# Altium project SVPXFMC_Carrier_3U.PrjPcb (part 5 of 7)

## Sheet FPGA_Config.SchDoc: SVPXFMC Carrier 3U
size 420 x 297 mm; CheckedBy: \; Author: G.Kasprowicz; CompanyName: ISE; DrawnBy: T.Przywozki; Organization: WUT ISE; Address1: Warsaw University of Technology; Address2: Nowowiejska 15/19 00-665 Warsaw; Revision: 1.0.; SheetNumber: 7; SheetTotal: 20; Project: SVPXFMC Carrier 3U; ModifiedBy: -; CheckedDate: -; Title2: FPGA Config; DivGrp: ISE; Designer: G. Kasprowicz
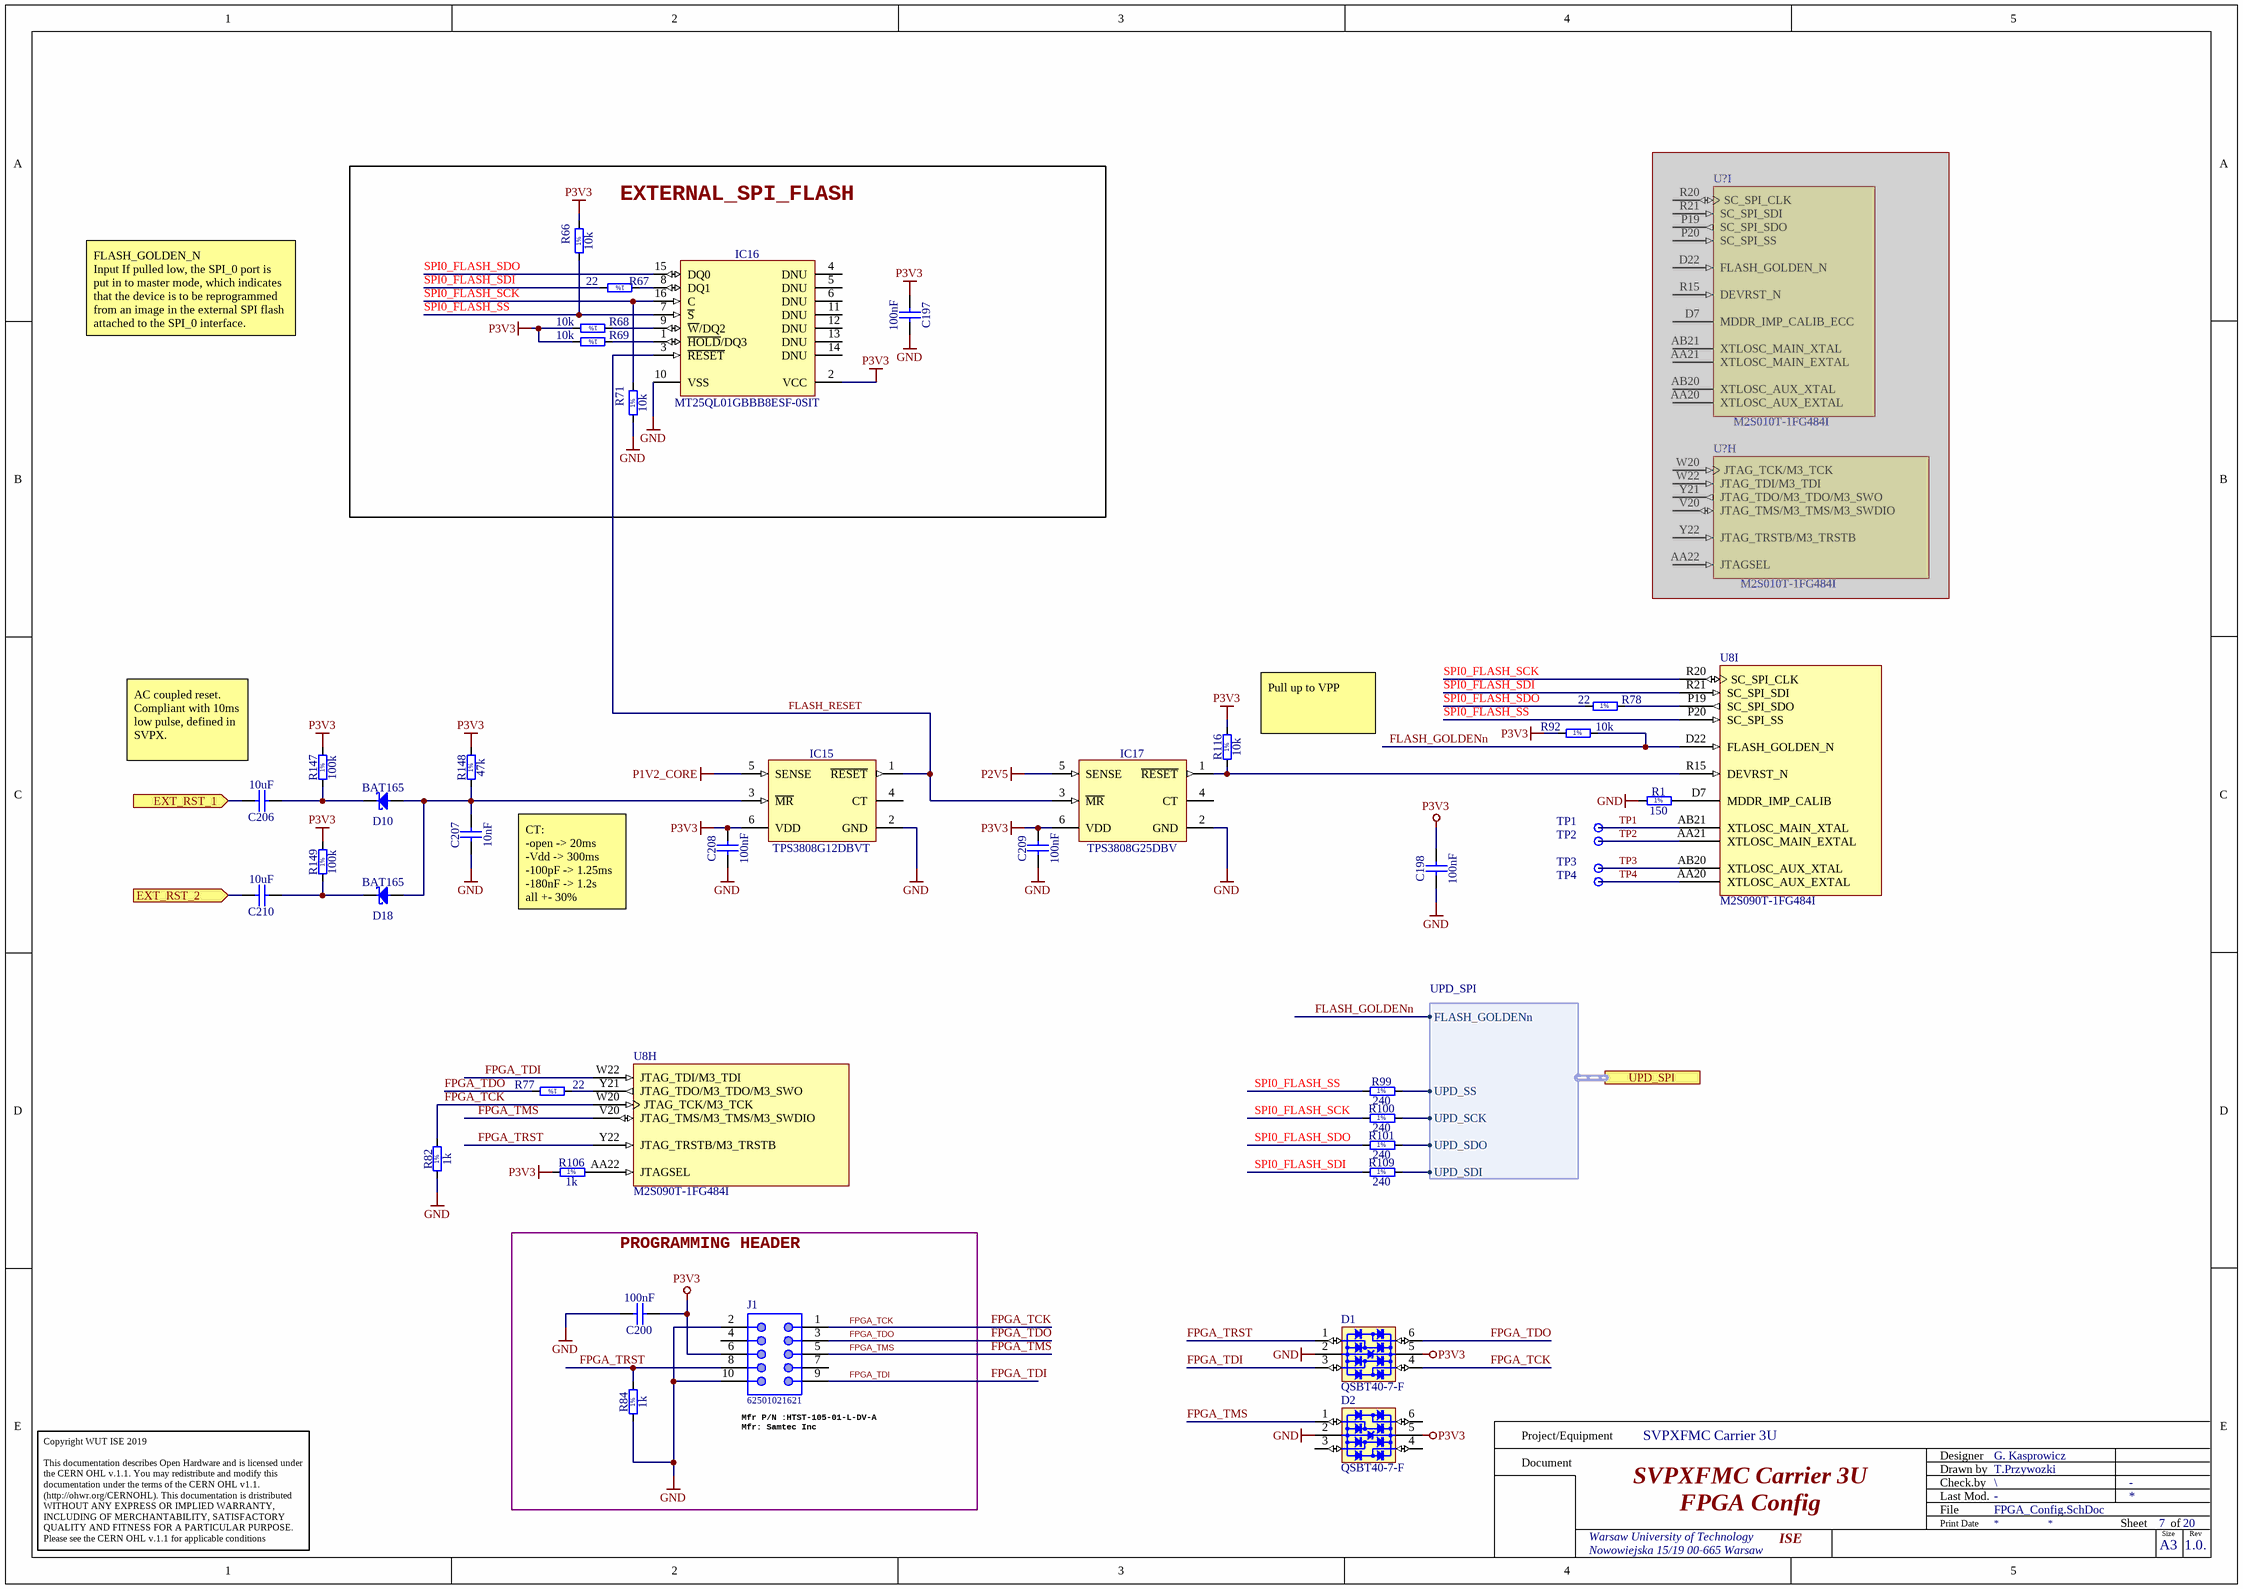
[diagram p10: FPGA_Config.SchDoc]

### Parts
(Parts that share a designator on the sheet are numbered #1, #2 ... from top to bottom, then left to right.)
C197  100nF  [CAPC0603X33N]
C198  100nF  [CAPC0603X33N]
C200  100nF  [CAPC0603X33N]
C206  10uF  [CAPC1608X80N]
C207  10nF  [CAPC1005X55N]
C208  100nF  [CAPC1005X55N]
C209  100nF  [CAPC1005X55N]
C210  10uF  [CAPC1608X80N]
D1  QSBT40-7-F  [SOT65P210X110-6N]
D2  QSBT40-7-F  [SOT65P210X110-6N]
D10  BAT165  [SOD2512X110N]
D18  BAT165  [SOD2512X110N]
IC15  TPS3808G12DBVT  [SOT95P280X145-6N]
IC16  MT25QL01GBBB8ESF-0SIT  [SOIC127P1030X265-16N]
IC17  TPS3808G25DBV  [SOT95P280X145-6N]
J1  62501021621  [62501021621]
R1  150  [RESC1005X40N]
R66  10k  [RESC1005X40N]
R67  22  [RESC1005X40N]
R68  10k  [RESC1005X40N]
R69  10k  [RESC1005X40N]
R71  10k  [RESC1005X40N]
R77  22  [RESC1005X40N]
R78  22  [RESC1005X40N]
R82  1k  [RESC1005X40N]
R84  1k  [RESC1005X40N]
R92  10k  [RESC1005X40N]
R99  240  [RESC1005X40N]
R100  240  [RESC1005X40N]
R101  240  [RESC1005X40N]
R106  1k  [RESC1005X40N]
R109  240  [RESC1005X40N]
R116  10k  [RESC1005X40N]
R147  100k  [RESC1005X40N]
R148  47k  [RESC1005X40N]
R149  100k  [RESC1005X40N]
TP1  Test Point  [TPS127]  (value not drawn)
TP2  Test Point  [TPS127]  (value not drawn)
TP3  Test Point  [TPS127]  (value not drawn)
TP4  Test Point  [TPS127]  (value not drawn)
U8  M2S090T-1FG484I  [MCSM-FG-484_V]  (parts H,I of 15)
U?#12  M2S010T-1FG484I  [MCSM-FG-484_V]  (part I of 16)  (masked out: inside a compile mask, not in the netlist)
U?#13  M2S010T-1FG484I  [MCSM-FG-484_V]  (part H of 16)  (masked out: inside a compile mask, not in the netlist)

### Blocks framed on the sheet
EXTERNAL_SPI_FLASH: C197 IC16 R66-R69 R71
PROGRAMMING HEADER: C200 J1 R84

### Ports
EXT_RST_1 (in), EXT_RST_2 (in), UPD_SPI (harness UPD_SPI)

### Harnesses
UPD_SPI: UPD_SS, UPD_SCK, UPD_SDO, UPD_SDI, FLASH_GOLDENn

### Nets
GND: C197.1 C198.1 C200.2 C207.1 C208.1 C209.1 D1.2(GND) D2.2(GND) IC15.2(GND) IC16.10(VSS) IC17.2(GND) J1.2 J1.10 R1.1 R71.1 R82.1 R84.1
P1V2_CORE: IC15.5(SENSE)
P2V5: IC17.5(SENSE)
P3V3: C197.2 C198.2 C200.1 C208.2 C209.2 D1.5(VBUS) D2.5(VBUS) IC15.6(VDD) IC16.2(VCC) IC17.6(VDD) J1.6 R66.2 R68.2 R69.2 R92.1 R106.1 R116.2 R147.2 R148.2 R149.2
EXT_RST_2: C210.2 ; port EXT_RST_2
FLASH_GOLDENn: R92.2 U8.D22(FLASH_GOLDEN_N) ; port UPD_SPI.FLASH_GOLDENn
FLASH_RESET: IC15.1(~{RESET}) IC16.3(~{RESET}) IC17.3(~{MR})  [project net FLASH_RESET_7]
FPGA_TCK: D1.4(I/O3) J1.1 R82.2 U8.W20(JTAG_TCK/M3_TCK)  [project net FPGA_TCK_7]
FPGA_TDI: D1.3(I/O2) J1.9 U8.W22(JTAG_TDI/M3_TDI)  [project net FPGA_TDI_7]
FPGA_TDO: D1.6(I/O4) J1.3 R77.2  [project net FPGA_TDO_7]
FPGA_TMS: D2.1(I/O1) J1.5 U8.V20(JTAG_TMS/M3_TMS/M3_SWDIO)  [project net FPGA_TMS_7]
FPGA_TRST: D1.1(I/O1) J1.8 R84.2 U8.Y22(JTAG_TRSTB/M3_TRSTB)  [project net FPGA_TRST_7]
SPI0_FLASH_SCK: IC16.16(C) R71.2 R100.1 U8.R20(SC_SPI_CLK)  [project net SPI0_FLASH_SCK_7]
SPI0_FLASH_SDI: R67.2 R109.1 U8.R21(SC_SPI_SDI)  [project net SPI0_FLASH_SDI_7]
SPI0_FLASH_SDO: IC16.15(DQ0) R78.1 R101.1  [project net SPI0_FLASH_SDO_7]
SPI0_FLASH_SS: IC16.7(~{S}) R66.1 R99.1 U8.P20(SC_SPI_SS)  [project net SPI0_FLASH_SS_7]
SYSRESET*: C206.2 ; port EXT_RST_1
TP1: TP1.1 U8.AB21(XTLOSC_MAIN_XTAL)  [project net TP1_7]
TP2: TP2.1 U8.AA21(XTLOSC_MAIN_EXTAL)  [project net TP2_7]
TP3: TP3.1 U8.AB20(XTLOSC_AUX_XTAL)  [project net TP3_7]
TP4: TP4.1 U8.AA20(XTLOSC_AUX_EXTAL)  [project net TP4_7]
UPD_SCK: R100.2 ; port UPD_SPI.UPD_SCK
UPD_SDI: R109.2 ; port UPD_SPI.UPD_SDI
UPD_SDO: R101.2 ; port UPD_SPI.UPD_SDO
UPD_SS: R99.2 ; port UPD_SPI.UPD_SS
NetC206_1: C206.1 D10.1(C) R147.1
NetC207_2: C207.2 D10.2(A) D18.2(A) IC15.3(~{MR}) R148.1
NetC210_1: C210.1 D18.1(C) R149.1
NetIC16_1: IC16.1(~{HOLD}/DQ3) R69.1
NetIC16_8: IC16.8(DQ1) R67.1
NetIC16_9: IC16.9(~{W}/DQ2) R68.1
NetIC17_1: IC17.1(~{RESET}) R116.1 U8.R15(DEVRST_N)
NetR1_2: R1.2 U8.D7(MDDR_IMP_CALIB)
NetR77_1: R77.1 U8.Y21(JTAG_TDO/M3_TDO/M3_SWO)
NetR78_2: R78.2 U8.P19(SC_SPI_SDO)
NetR106_2: R106.2 U8.AA22(JTAGSEL)

Not connected (* = marked no-connect by the designer): D2 3(I/O2) 4(I/O3) 6(I/O4); IC15 4(CT); IC16 4(DNU) 5(DNU) 6(DNU) 11(DNU) 12(DNU) 13(DNU) 14(DNU); IC17 4(CT); J1 4 7

### Notes on the sheet
- FLASH_GOLDEN_N
  Input If pulled low, the SPI_0 port is put in to master mode, which indicates that the device is to be reprogrammed from an image in the external SPI flash attached to the SPI_0 interface.
- (near R116) Pull up to VPP
- (near C206) AC coupled reset. Compliant with 10ms low pulse, defined in SVPX.
- CT:
  -open -> 20ms
  -Vdd -> 300ms
  -100pF -> 1.25ms
  -180nF -> 1.2s
  all +- 30%
- (near J1) Mfr P/N :HTST-105-01-L-DV-A
  Mfr: Samtec Inc
- Project/Equipment
- Document
- Designer
- Drawn by
- Check.by
- File
- Last Mod.
- Print Date
- Sheet
- Size
- A3
- of
- Rev
- Copyright WUT ISE 2019
  This documentation describes Open Hardware and is licensed under the CERN OHL v.1.1. You may redistribute and modify this documentation under the terms of the CERN OHL v1.1.
  (http://ohwr.org/CERNOHL). This documentation is dristributed WITHOUT ANY EXPRESS OR IMPLIED WARRANTY, INCLUDING OF MERCHANTABILITY, SATISFACTORY QUALITY AND FITNESS FOR A PARTICULAR PURPOSE. Please see the CERN OHL v.1.1 for applicable conditions
- (in symbol R0402_1K_1%_0.0625W_100PPM) 1%
- (in symbol R0402_10K_1%_0.0625W_100PPM) 1%
- (in symbol R0402_22R_1%_0.0625W_100PPM) 1%
- (in symbol R0402_47K_1%_0.0625W_100PPM) 1%
- (in symbol R0402_100K_1%_0.0625W_100PPM) 1%
- (in symbol R0402_150R_1%_0.0625W_100PPM) 1%
- (in symbol R0402_240R_1%_0.0625W_100PPM) 1%

### Library data of the parts
C197 C200 = CC0201_100NF_6.3V_10%_X5R: as C34 on sheet FPGA Supply; Part Number: CC0201_100NF_6.3V_10%_X5R; Component Kind: Standard; Component Type: Standard; Pin Count: 2; Value: 100nF; Status: Not Recommended; Manufacturer Part Number: CC0201_100NF_6.3V_10%_X5R; Case: 0201; Mounted: Yes; Socket: No; SMD: Yes; Sense: No; Manufacturer1 Example: AVX; Manufacturer1 ComponentHeight: 0.33mm; HelpURL: \\cern.ch\dfs\Applications\Altium\Datasheets\CC0201_X5R_AVX.pdf; Author: CERN DEM JLC; CreateDate: 03/12/2007; LatestRevisionDate: 03/12/2007
C198 = CC0201_100NF_6.3V_10%_X5R: Non-polarised capacitor; Manufacturer: GENERIC; Part Description: SMD Multilayer Chip Ceramic Capacitor; Manufacturer1 Part Number: 02016D104KAT2A; Tolerance: ±10%; Voltage: 6.3V; TC: X5R; Part Number: CC0201_100NF_6.3V_10%_X5R; Component Kind: Standard; Component Type: Standard; Pin Count: 2; Value: 100nF; Status: Not Recommended; Manufacturer Part Number: CC0201_100NF_6.3V_10%_X5R; Case: 0201; Mounted: Yes; Socket: No; SMD: Yes; Sense: No; Manufacturer1 Example: AVX; Manufacturer1 ComponentHeight: 0.33mm; HelpURL: \\cern.ch\dfs\Applications\Altium\Datasheets\CC0201_X5R_AVX.pdf; Author: CERN DEM JLC; CreateDate: 03/12/2007; LatestRevisionDate: 03/12/2007
C206 C210 = CC0603_10UF_16V_20%_X5R: Non-polarised capacitor; Part Description: SMD Multilayer Chip Ceramic Capacitor; Manufacturer: GENERIC; Manufacturer1 Part Number: GRM188R61C106MA73D; Voltage: 16V; TC: X5R; Tolerance: ±20%; Part Number: CC0603_10UF_16V_20%_X5R; Component Kind: Standard; Component Type: Standard; Pin Count: 2; Value: 10uF; Status: None; Manufacturer Part Number: CC0603_10UF_16V_20%_X5R; Case: 0603; Mounted: Yes; Socket: No; SMD: Yes; Sense: No; Manufacturer1 Example: MURATA; Manufacturer1 ComponentHeight: 0.8mm; HelpURL: \\cern.ch\dfs\Applications\Altium\Datasheets\CC0603_X5R_MURATA_GRM.pdf; Author: CERN DEM MR; CreateDate: 2016-03-02; LatestRevisionDate: 2016-03-02
C207 = CC0402_10NF_50V_10%_X7R: Non-polarised capacitor; Part Description: SMD Multilayer Chip Ceramic Capacitor; Manufacturer: GENERIC; Manufacturer1 Part Number: GRM155R71H103KA88D; Voltage: 50V; TC: X7R; Tolerance: ±10%; Part Number: CC0402_10NF_50V_10%_X7R; Component Kind: Standard; Component Type: Standard; Pin Count: 2; Value: 10nF; Status: None; Manufacturer Part Number: CC0402_10NF_50V_10%_X7R; Case: 0402; Mounted: Yes; Socket: No; SMD: Yes; Sense: No; Manufacturer1 Example: MURATA; Manufacturer1 ComponentHeight: 0.55mm; HelpURL: \\cern.ch\dfs\Applications\Altium\Datasheets\CC0402_X7R_MURATA_GRM.pdf; Author: CERN DEM MR; CreateDate: 08.01.2016; LatestRevisionDate: 08.01.2016
C208 C209 = CC0402_100NF_25V_10%_X7R_YUDEN_TMK105B7104KVHF: as C6 on sheet Power_supply; Part Number: CC0402_100NF_25V_10%_X7R_YUDEN_TMK105B7104KVHF; Component Kind: Standard; Component Type: Standard; Pin Count: 2; Value: 100nF; Status: Not Recommended; Manufacturer Part Number: TMK105B7104KVHF; Case: 0402; Mounted: Yes; Socket: No; SMD: Yes; Sense: No; HelpURL: \\cern.ch\dfs\Applications\Altium\Datasheets\CC0402_TAIYO-YUDEN_TMK105B7104KVHF.pdf; Author: CERN DEM JLC; CreateDate: 10.05.2017; LatestRevisionDate: 10.05.2017; ComponentHeight: 0.55mm
D1 D2 = D_TVS_QSBT40-7-F: Bonding: No; PressFit: No; Case: *; Component Kind: Standard; Component Type: Standard; ComponentHeigth: *; CreateDate: 2018-01-01; Device: QSBT40-7-F; Footprint: SOT363; HelpURL: *; LatestRevisionDate: 2018-01-01; Manufacturer: *; Manufacturer Part Number: QSBT40-7-F; Mounted: Yes; PackageDescription: *; Part Description: *; Part Number: *; Pin Count: 6; Sense: No; SMD: Yes; Socket: No; Value: *
D10 D18 = BAT165: Schottky Diode; Part Description: Medium Power AF Schottky Diode; Manufacturer: INFINEON; Voltage: 40V; Power: 750mA; PressFit: No; Bonding: No; Part Number: BAT165; Component Kind: Standard; Component Type: Standard; Device: BAT165; PackageDescription: Small Outline Diode (SOD-323), 1.70mm W X 1.25mm L X 1.10mm H body,  IPC Medium Density; Manufacturer Part Number: BAT165; Pin Count: 2; Case: SOD323; Mounted: Yes; Socket: No; SMD: Yes; Sense: No; ComponentHeight: 1.1mm; HelpURL: \\cern.ch\dfs\Applications\Altium\Datasheets\BAT165.pdf; Author: CERN DEM JLC; CreateDate: 12.11.2014; LatestRevisionDate: 12.11.2014
IC15 = TPS3808G12DBVT: Low Quiescent Current, Programmable-Delay Supervisory Circuit; Part Description: 1.2V, Low Quiescent Current, Programmable-Delay Supervisory Circuit; Manufacturer: TEXAS INSTRUMENTS; PressFit: No; Bonding: No; Part Number: TPS3808G12DBVT; Component Kind: Standard; Component Type: Standard; Device: TPS3808G12DBVT; PackageDescription: SOT23, 6-Leads, Body 1.6x3.0mm, Pitch 0.95mm, IPC Medium Density; Manufacturer Part Number: TPS3808G12DBVT; Pin Count: 6; Case: SOT23-6; Mounted: Yes; Socket: No; SMD: Yes; Sense: No; ComponentHeight: 1.45mm; Author: CERN DEM JLC; HelpURL: \\cern.ch\dfs\Applications\Altium\Datasheets\TPS3808G12DBVT.pdf; CreateDate: 05.11.2013; LatestRevisionDate: 05.11.2013
IC16 = MEM_MT25QL01GBBB8ESF-0SIT: 1Gbit (128MB), 3.3V, Multiple I/O Serial Flash Memory, Reset# & Hold# Pinset# & Hold# Pins; Manufacturer: MICRON TECHNOLOGY; PressFit: No; Bonding: No; Part Number: MT25QL01GBBB8ESF-0SIT; Component Kind: Standard; Component Type: Standard; Device: MT25QL01GBBB8ESF-0SIT; PackageDescription: SOIC 16, Pitch 1.27mm - Body 7.5x10.3mm, IPC Medium Density; Part Description: 1Gbit (128MB), 3.3V, Multiple I/O Serial Flash Memory, Reset# & Hold# Pins; Manufacturer Part Number: MT25QL01GBBB8ESF-0SIT; Pin Count: 16; Case: SOIC16; Mounted: Yes; Socket: No; SMD: Yes; Sense: No; ComponentHeight: 2.65mm; HelpURL: \\cern.ch\dfs\Applications\Altium\Datasheets\MT25QL01GBBB8ESF-0SIT.pdf; Author: CERN DEM MR; CreateDate: 26/01/2018; LatestRevisionDate: 26/01/2018
IC17 = TPS3808G25DBV: Low Quiescent Current, Programmable-Delay Supervisory Circuit; Part Description: 2.5V, Low Quiescent Current, Programmable-Delay Supervisory Circuit; Manufacturer: TEXAS INSTRUMENTS; PressFit: No; Bonding: No; Part Number: TPS3808G25DBV; Component Kind: Standard; Component Type: Standard; Device: TPS3808G25DBV; PackageDescription: SOT23, 6-Leads, Body 1.6x3.0mm, Pitch 0.95mm, IPC Medium Density; Manufacturer Part Number: TPS3808G25DBV; Pin Count: 6; Case: SOT23-6; Mounted: Yes; Socket: No; SMD: Yes; Sense: No; ComponentHeight: 1.45mm; Author: CERN DEM MR; HelpURL: \\cern.ch\dfs\Applications\Altium\Datasheets\TPS3808G25DBV.pdf; CreateDate: 13.07.2016; LatestRevisionDate: 13.07.2016
J1 = 62501021621: Male Box Header WR-BHD with long lever, THT, Vertical, pitch 2.00 mm, 10 pins; Pin Number: 10; Pitch: 2.00 mm; Working Voltage: 250 VAC; Withstanding Voltage: 500 VAC; Contact Resistance: 20 mOhm; ComponentLink1Description: Manufacturer; ComponentLink1URL: http://www.we-online.de; ComponentLink2Description: Datasheet; ComponentLink2URL: https://katalog.we-online.de/em/datasheet/6250xx21621.pdf; Part Number: 62501021621; Published Date: August 2018; Publisher: Wurth Elektronik; Operating Temperature: -40 to 125 degC; Packaging: Tray; Gender: Male; Mounting Technology: THT; Orientation: Vertical
R1 = R0402_150R_1%_0.0625W_100PPM: Resistor - 1%; Part Description: General Purpose Thick Film Chip Resistor; Manufacturer: GENERIC; Manufacturer1 Part Number: 232270671501L; TC: ±100ppm/°C; PressFit: No; Part Number: R0402_150R_1%_0.0625W_100PPM; Component Kind: Standard; Component Type: Standard; Pin Count: 2; Value: 150; Status: Not Recommended; Power: 0.0625W; Tolerance: ±1%; Manufacturer Part Number: R0402_150R_1%_0.0625W_100PPM; Case: 0402; Mounted: Yes; Sense: No; Socket: No; SMD: Yes; Manufacturer1 Example: YAGEO PHYCOMP; Manufacturer1 ComponentHeight: 0.4mm; HelpURL: \\cern.ch\dfs\Applications\Altium\Datasheets\R0402_Phycomp_RC0402.pdf; Author: CERN DEM JLC; CreateDate: 03.12.2007; LatestRevisionDate: 17.10.2012
R66 R68 R69 R71 R92 = R0402_10K_1%_0.0625W_100PPM: Resistor - 1%; Manufacturer: GENERIC; Part Description: General Purpose Thick Film Chip Resistor; Manufacturer1 Part Number: 232270671003L; TC: ±100ppm/°C; PressFit: No; Manufacturer Part Number: R0402_10K_1%_0.0625W_100PPM; Part Number: R0402_10K_1%_0.0625W_100PPM; Tolerance: ±1%; Value: 10k; Component Kind: Standard; Component Type: Standard; Pin Count: 2; Status: Not Recommended; Power: 0.0625W; Case: 0402; Mounted: Yes; Sense: No; Socket: No; SMD: Yes; Manufacturer1 Example: YAGEO PHYCOMP; Manufacturer1 ComponentHeight: 0.4mm; HelpURL: \\cern.ch\dfs\Applications\Altium\Datasheets\R0402_Phycomp_RC0402.pdf; Author: CERN DEM JLC; CreateDate: 03/12/2007; LatestRevisionDate: 17/10/2012
R67 R77 = R0402_22R_1%_0.0625W_100PPM: Resistor - 1%; Manufacturer: GENERIC; Part Description: General Purpose Thick Film Chip Resistor; Manufacturer1 Part Number: 232270672209L; TC: ±100ppm/°C; PressFit: No; Part Number: R0402_22R_1%_0.0625W_100PPM; Component Kind: Standard; Component Type: Standard; Pin Count: 2; Value: 22; Status: Not Recommended; Power: 0.0625W; Tolerance: ±1%; Manufacturer Part Number: R0402_22R_1%_0.0625W_100PPM; Case: 0402; Mounted: Yes; Sense: No; Socket: No; SMD: Yes; Manufacturer1 Example: YAGEO PHYCOMP; Manufacturer1 ComponentHeight: 0.4mm; HelpURL: \\cern.ch\dfs\Applications\Altium\Datasheets\R0402_Phycomp_RC0402.pdf; Author: CERN DEM JLC; CreateDate: 03/12/2007; LatestRevisionDate: 17/10/2012
R78 = R0402_22R_1%_0.0625W_100PPM: Resistor - 1%; Part Description: General Purpose Thick Film Chip Resistor; Manufacturer: GENERIC; Manufacturer1 Part Number: 232270672209L; TC: ±100ppm/°C; PressFit: No; Part Number: R0402_22R_1%_0.0625W_100PPM; Component Kind: Standard; Component Type: Standard; Pin Count: 2; Value: 22; Status: Not Recommended; Power: 0.0625W; Tolerance: ±1%; Manufacturer Part Number: R0402_22R_1%_0.0625W_100PPM; Case: 0402; Mounted: Yes; Sense: No; Socket: No; SMD: Yes; Manufacturer1 Example: YAGEO PHYCOMP; Manufacturer1 ComponentHeight: 0.4mm; HelpURL: \\cern.ch\dfs\Applications\Altium\Datasheets\R0402_Phycomp_RC0402.pdf; Author: CERN DEM JLC; CreateDate: 03/12/2007; LatestRevisionDate: 17/10/2012
R82 R84 R106 = R0402_1K_1%_0.0625W_100PPM: Resistor - 1%; Part Description: General Purpose Thick Film Chip Resistor; Manufacturer: GENERIC; Manufacturer1 Part Number: 232270671002L; TC: ±100ppm/°C; PressFit: No; Part Number: R0402_1K_1%_0.0625W_100PPM; Component Kind: Standard; Component Type: Standard; Pin Count: 2; Value: 1k; Status: Not Recommended; Power: 0.0625W; Tolerance: ±1%; Manufacturer Part Number: R0402_1K_1%_0.0625W_100PPM; Case: 0402; Mounted: Yes; Sense: No; Socket: No; SMD: Yes; Manufacturer1 Example: YAGEO PHYCOMP; Manufacturer1 ComponentHeight: 0.4mm; HelpURL: \\cern.ch\dfs\Applications\Altium\Datasheets\R0402_Phycomp_RC0402.pdf; Author: CERN DEM JLC; CreateDate: 03/12/2007; LatestRevisionDate: 17/10/2012
R99-R101 R109 = R0402_240R_1%_0.0625W_100PPM: Resistor - 1%; Part Description: General Purpose Thick Film Chip Resistor; Manufacturer: GENERIC; Manufacturer1 Part Number: 232270672401L; TC: ±100ppm/°C; PressFit: No; Part Number: R0402_240R_1%_0.0625W_100PPM; Component Kind: Standard; Component Type: Standard; Pin Count: 2; Value: 240; Status: Not Recommended; Power: 0.0625W; Tolerance: ±1%; Manufacturer Part Number: R0402_240R_1%_0.0625W_100PPM; Case: 0402; Mounted: Yes; Sense: No; Socket: No; SMD: Yes; Manufacturer1 Example: YAGEO PHYCOMP; Manufacturer1 ComponentHeight: 0.4mm; HelpURL: \\cern.ch\dfs\Applications\Altium\Datasheets\R0402_Phycomp_RC0402.pdf; Author: CERN DEM JLC; CreateDate: 03/12/2007; LatestRevisionDate: 17/10/2012
R116 = R0402_10K_1%_0.0625W_100PPM: Resistor - 1%; Part Description: General Purpose Thick Film Chip Resistor; Manufacturer: GENERIC; Manufacturer1 Part Number: 232270671003L; TC: ±100ppm/°C; PressFit: No; Part Number: R0402_10K_1%_0.0625W_100PPM; Component Kind: Standard; Component Type: Standard; Pin Count: 2; Value: 10k; Status: Not Recommended; Power: 0.0625W; Tolerance: ±1%; Manufacturer Part Number: R0402_10K_1%_0.0625W_100PPM; Case: 0402; Mounted: Yes; Sense: No; Socket: No; SMD: Yes; Manufacturer1 Example: YAGEO PHYCOMP; Manufacturer1 ComponentHeight: 0.4mm; HelpURL: \\cern.ch\dfs\Applications\Altium\Datasheets\R0402_Phycomp_RC0402.pdf; Author: CERN DEM JLC; CreateDate: 03.12.2007; LatestRevisionDate: 17.10.2012
R147 R149 = R0402_100K_1%_0.0625W_100PPM: Resistor - 1%; Part Description: General Purpose Thick Film Chip Resistor; Manufacturer: GENERIC; Manufacturer1 Part Number: 232270671004L; TC: ±100ppm/°C; PressFit: No; Part Number: R0402_100K_1%_0.0625W_100PPM; Component Kind: Standard; Component Type: Standard; Pin Count: 2; Value: 100k; Status: Not Recommended; Power: 0.0625W; Tolerance: ±1%; Manufacturer Part Number: R0402_100K_1%_0.0625W_100PPM; Case: 0402; Mounted: Yes; Sense: No; Socket: No; SMD: Yes; Manufacturer1 Example: YAGEO PHYCOMP; Manufacturer1 ComponentHeight: 0.4mm; HelpURL: \\cern.ch\dfs\Applications\Altium\Datasheets\R0402_Phycomp_RC0402.pdf; Author: CERN DEM JLC; CreateDate: 03.12.2007; LatestRevisionDate: 17.10.2012
R148 = R0402_47K_1%_0.0625W_100PPM: Resistor - 1%; Part Description: General Purpose Thick Film Chip Resistor; Manufacturer: GENERIC; Manufacturer1 Part Number: 232270675103L; TC: ±100ppm/°C; PressFit: No; Part Number: R0402_47K_1%_0.0625W_100PPM; Component Kind: Standard; Component Type: Standard; Pin Count: 2; Value: 47k; Status: Not Recommended; Power: 0.0625W; Tolerance: ±1%; Manufacturer Part Number: R0402_47K_1%_0.0625W_100PPM; Case: 0402; Mounted: Yes; Sense: No; Socket: No; SMD: Yes; Manufacturer1 Example: YAGEO PHYCOMP; Manufacturer1 ComponentHeight: 0.4mm; HelpURL: \\cern.ch\dfs\Applications\Altium\Datasheets\R0402_Phycomp_RC0402.pdf; Author: CERN DEM JLC; CreateDate: 03.12.2007; LatestRevisionDate: 17.10.2012
TP1-TP4 = SMD_PAD_1.27X1.27MM: as TP9 on sheet Power_supply; Part Number: SMD_PAD_1.27X1.27MM; Component Kind: Standard (No BOM); Component Type: Standard (No BOM); Pin Count: 1; Family: Test Point; Socket: No; SMD: Yes; Sense: No; Status: None; ComponentHeight: 0mm; HelpURL: Undefined; Author: CERN DEM JLC; CreateDate: 12.01.2008; LatestRevisionDate: 12.01.2008; PackageDescription: 1.27mm x 1.27mm PCB Copper Area (SMD Test Point)
U8 = CMP-0959-00045-1: as U8 on sheet FPGA SDRAM bank; ComponentLink3URL: http://www.microsemi.com/document-portal/doc_download/131095-package-mechanical-drawings; DatasheetVersion: Rev. 5; ComponentLink3Description: Package Specification; ComponentLink1Description: Manufacturer URL; PackageReference: FG-484; RoHS: FALSE; ComponentLink1URL: http://www.microsemi.com/; Code_JEDEC: MS-034; Mounting Technology: Surface Mount; PackageDescription: 484-Ball Fine Pitch Plastic Ball Grid Array (FBGA), Body 23 x 23 mm, Pitch 1 mm; PackageVersion: Rev. 48, 11/2013; ComponentLink2URL: http://www.microsemi.com/document-portal/doc_download/130717-smartfusion2-datasheet; PartNumber: M2S090T-1FG484I; ComponentLink2Description: Datasheet; PartId: 1
U?#12 U?#13 = CMP-0959-00069-1: as U?#7 on sheet FPGA SDRAM bank; PackageVersion: Rev. 48, 11/2013; ComponentLink3URL: http://www.microsemi.com/document-portal/doc_download/131095-package-mechanical-drawings; ComponentLink1Description: Manufacturer URL; DatasheetVersion: Rev. 5; RoHS: FALSE; ComponentLink2Description: Datasheet; Code_JEDEC: MS-034; ComponentLink3Description: Package Specification; ComponentLink2URL: http://www.microsemi.com/document-portal/doc_download/130717-smartfusion2-datasheet; PartNumber: M2S010T-1FG484I; ComponentLink1URL: http://www.microsemi.com/; Math Blocks (18x18): 22; Mounting Technology: Surface Mount; PackageDescription: 484-Ball Fine Pitch Plastic Ball Grid Array (FBGA), Body 23 x 23 mm, Pitch 1 mm; PackageReference: FG-484

## Sheet Decoupling_caps.SchDoc: SVPXFMC Carrier 3U
size A4; CheckedBy: \; Author: G.Kasprowicz; CompanyName: ISE; DrawnBy: T.Przywozki; Organization: WUT ISE; Address1: Warsaw University of Technology; Address2: Nowowiejska 15/19 00-665 Warsaw; Revision: 1.0.; SheetNumber: 3; SheetTotal: 20; Projet: SVPXFMC Carrier 3U; ModifiedBy: -; CreateDate: XX/XX/XXXX; CheckedDate: -; Title2: Decoupling Caps; DivGrp: ISE; Designer: G. Kasprowicz; Project: SVPXFMC Carrier 3U
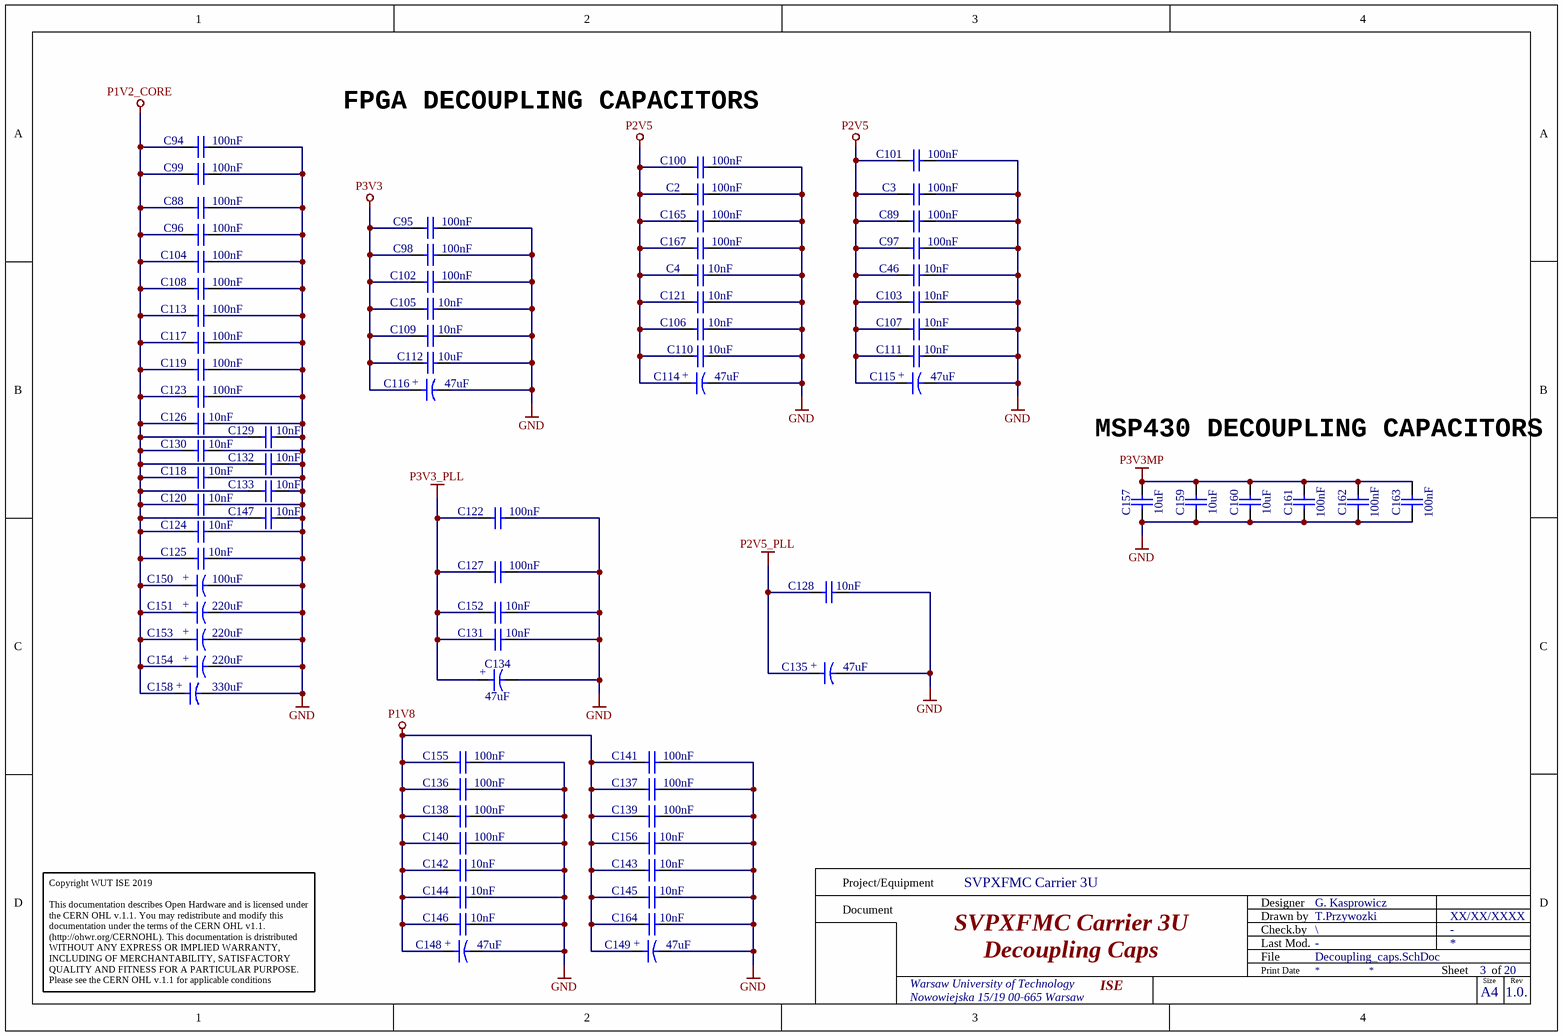
[diagram p11: Decoupling_caps.SchDoc]

### Parts
C2  100nF  [CAPC0603X33N]
C3  100nF  [CAPC0603X33N]
C4  10nF  [CAPC0603X33N]
C46  10nF  [CAPC0603X33N]
C88  100nF  [CAPC0603X33N]
C89  100nF  [CAPC0603X33N]
C94  100nF  [CAPC0603X33N]
C95  100nF  [CAPC0603X33N]
C96  100nF  [CAPC0603X33N]
C97  100nF  [CAPC0603X33N]
C98  100nF  [CAPC0603X33N]
C99  100nF  [CAPC0603X33N]
C100  100nF  [CAPC0603X33N]
C101  100nF  [CAPC0603X33N]
C102  100nF  [CAPC0603X33N]
C103  10nF  [CAPC0603X33N]
C104  100nF  [CAPC0603X33N]
C105  10nF  [CAPC0603X33N]
C106  10nF  [CAPC0603X33N]
C107  10nF  [CAPC0603X33N]
C108  100nF  [CAPC0603X33N]
C109  10nF  [CAPC0603X33N]
C110  10uF  [CAPC2012X135N]
C111  10nF  [CAPC0603X33N]
C112  10uF  [CAPC2012X135N]
C113  100nF  [CAPC0603X33N]
C114  47uF  [CAPMP3528X210N]
C115  47uF  [CAPMP3528X210N]
C116  47uF  [CAPMP3528X210N]
C117  100nF  [CAPC0603X33N]
C118  10nF  [CAPC0603X33N]
C119  100nF  [CAPC0603X33N]
C120  10nF  [CAPC0603X33N]
C121  10nF  [CAPC0603X33N]
C122  100nF  [CAPC0603X33N]
C123  100nF  [CAPC0603X33N]
C124  10nF  [CAPC0603X33N]
C125  10nF  [CAPC0603X33N]
C126  10nF  [CAPC0603X33N]
C127  100nF  [CAPC0603X33N]
C128  10nF  [CAPC0603X33N]
C129  10nF  [CAPC0603X33N]
C130  10nF  [CAPC0603X33N]
C131  10nF  [CAPC0603X33N]
C132  10nF  [CAPC0603X33N]
C133  10nF  [CAPC0603X33N]
C134  47uF  [CAPMP3528X210N]
C135  47uF  [CAPMP3528X210N]
C136  100nF  [CAPC0603X33N]
C137  100nF  [CAPC0603X33N]
C138  100nF  [CAPC0603X33N]
C139  100nF  [CAPC0603X33N]
C140  100nF  [CAPC0603X33N]
C141  100nF  [CAPC0603X33N]
C142  10nF  [CAPC0603X33N]
C143  10nF  [CAPC0603X33N]
C144  10nF  [CAPC0603X33N]
C145  10nF  [CAPC0603X33N]
C146  10nF  [CAPC0603X33N]
C147  10nF  [CAPC0603X33N]
C148  47uF  [CAPMP3528X210N]
C149  47uF  [CAPMP3528X210N]
C150  100uF  [CAPMP3528X210N]
C151  220uF  [CAPMP7343X310N]
C152  10nF  [CAPC0603X33N]
C153  220uF  [CAPMP7343X310N]
C154  220uF  [CAPMP7343X310N]
C155  100nF  [CAPC0603X33N]
C156  10nF  [CAPC0603X33N]
C157  10uF  [CAPC1608X80N]
C158  330uF  [CAPMP7343X310N]
C159  10uF  [CAPC1608X80N]
C160  10uF  [CAPC1608X80N]
C161  100nF  [CAPC1005X55N]
C162  100nF  [CAPC1005X55N]
C163  100nF  [CAPC1005X55N]
C164  10nF  [CAPC0603X33N]
C165  100nF  [CAPC0603X33N]
C167  100nF  [CAPC0603X33N]

### Nets
GND: C2.2 C3.2 C4.2 C46.2 C88.2 C89.2 C94.2 C95.2 C96.2 C97.2 C98.2 C99.2 C100.2 C101.2 C102.2 C103.2 C104.2 C105.2 C106.2 C107.2 C108.2 C109.2 C110.2 C111.2 C112.2 C113.2 C114.2 C115.2 C116.2 C117.2 C118.2 C119.2 C120.2 C121.2 C122.2 C123.2 C124.2 C125.2 C126.2 C127.2 C128.2 C129.2 C130.2 C131.2 C132.2 C133.2 C134.2 C135.2 C136.2 C137.2 C138.2 C139.2 C140.2 C141.2 C142.2 C143.2 C144.2 C145.2 C146.2 C147.2 C148.2 C149.2 C150.2 C151.2 C152.2 C153.2 C154.2 C155.2 C156.2 C157.1 C158.2 C159.1 C160.1 C161.1 C162.1 C163.1 C164.2 C165.2 C167.2
P1V2_CORE: C88.1 C94.1 C96.1 C99.1 C104.1 C108.1 C113.1 C117.1 C118.1 C119.1 C120.1 C123.1 C124.1 C125.1 C126.1 C129.1 C130.1 C132.1 C133.1 C147.1 C150.1 C151.1 C153.1 C154.1 C158.1
P1V8: C136.1 C137.1 C138.1 C139.1 C140.1 C141.1 C142.1 C143.1 C144.1 C145.1 C146.1 C148.1 C149.1 C155.1 C156.1 C164.1
P2V5: C2.1 C3.1 C4.1 C46.1 C89.1 C97.1 C100.1 C101.1 C103.1 C106.1 C107.1 C110.1 C111.1 C114.1 C115.1 C121.1 C165.1 C167.1
P2V5_PLL: C128.1 C135.1
P3V3: C95.1 C98.1 C102.1 C105.1 C109.1 C112.1 C116.1
P3V3_PLL: C122.1 C127.1 C131.1 C134.1 C152.1
P3V3MP: C157.2 C159.2 C160.2 C161.2 C162.2 C163.2

### Notes on the sheet
- FPGA DECOUPLING CAPACITORS
- MSP430 DECOUPLING CAPACITORS
- Project/Equipment
- Document
- Designer
- Drawn by
- Check.by
- Copyright WUT ISE 2019
  This documentation describes Open Hardware and is licensed under the CERN OHL v.1.1. You may redistribute and modify this documentation under the terms of the CERN OHL v1.1.
  (http://ohwr.org/CERNOHL). This documentation is dristributed WITHOUT ANY EXPRESS OR IMPLIED WARRANTY, INCLUDING OF MERCHANTABILITY, SATISFACTORY QUALITY AND FITNESS FOR A PARTICULAR PURPOSE. Please see the CERN OHL v.1.1 for applicable conditions
- File
- Last Mod.
- Print Date
- Sheet
- Size
- A4
- of
- Rev
- (in symbol CTE3528-12_47UF_10V_20%_PANASONIC_TPB) +
- (in symbol CTE3528-21_100UF_6.3V_10%) +
- (in symbol CTE7343-31_220UF_6.3V_20%_LESR0009_KEMET_T520) +
- (in symbol CTE7343-31_330UF_6.3V_20%_LESR0025_KEMET_T520) +

### Library data of the parts
C2 C3 C88 C89 C94-C102 C104 C108 C113 C117 C119 C122 C123 C127 C136-C141 C155 C165 C167 = CC0201_100NF_6.3V_10%_X5R: Non-polarised capacitor; Manufacturer: GENERIC; Part Description: SMD Multilayer Chip Ceramic Capacitor; Manufacturer1 Part Number: 02016D104KAT2A; Voltage: 6.3V; TC: X5R; Tolerance: ±10%; Part Number: CC0201_100NF_6.3V_10%_X5R; Component Kind: Standard; Component Type: Standard; Pin Count: 2; Value: 100nF; Status: Not Recommended; Manufacturer Part Number: CC0201_100NF_6.3V_10%_X5R; Case: 0201; Mounted: Yes; Socket: No; SMD: Yes; Sense: No; Manufacturer1 Example: AVX; Manufacturer1 ComponentHeight: 0.33mm; HelpURL: \\cern.ch\dfs\Applications\Altium\Datasheets\CC0201_X5R_AVX.pdf; Author: CERN DEM JLC; CreateDate: 03/12/2007; LatestRevisionDate: 03/12/2007
C4 C46 C103 C105-C107 C109 C111 C118 C120 C121 C124-C126 C128-C133 C142-C147 C152 C156 C164 = CC0201_10NF_10V_10%_X5R: Non-polarised capacitor; Manufacturer: GENERIC; Part Description: SMD Multilayer Chip Ceramic Capacitor; Manufacturer1 Part Number: 0201ZD103KAT2A; Voltage: 10V; TC: X5R; Tolerance: ±10%; Part Number: CC0201_10NF_10V_10%_X5R; Component Kind: Standard; Component Type: Standard; Pin Count: 2; Value: 10nF; Status: Not Recommended; Manufacturer Part Number: CC0201_10NF_10V_10%_X5R; Case: 0201; Mounted: Yes; Socket: No; SMD: Yes; Sense: No; Manufacturer1 Example: AVX; Manufacturer1 ComponentHeight: 0.33mm; HelpURL: \\cern.ch\dfs\Applications\Altium\Datasheets\CC0201_X5R_AVX.pdf; Author: CERN DEM JLC; CreateDate: 03/12/2007; LatestRevisionDate: 03/12/2007
C110 C112 = CC0805_10UF_16V_10%_X5R: Non-polarised capacitor; Part Description: SMD Multilayer Chip Ceramic Capacitor; Manufacturer: GENERIC; Manufacturer1 Part Number: C0805C106K4PAC; Voltage: 16V; TC: X5R; Tolerance: ±10%; Part Number: CC0805_10UF_16V_10%_X5R; Component Kind: Standard; Component Type: Standard; Pin Count: 2; Value: 10uF; Status: Preferred; Manufacturer Part Number: CC0805_10UF_16V_10%_X5R; Case: 0805; Mounted: Yes; Socket: No; SMD: Yes; Sense: No; Manufacturer1 Example: KEMET; Manufacturer1 ComponentHeight: 1.4mm; HelpURL: \\cern.ch\dfs\Applications\Altium\Datasheets\CC1206_X5R_KEMET.pdf; Author: CERN DEM JLC; CreateDate: 03/12/2007; LatestRevisionDate: 03/12/2007
C114-C116 C134 C135 C148 C149 = CTE3528-12_47UF_10V_20%_PANASONIC_TPB: Polarised capacitor; Part Description: ESR 0R07 Tantalum Solid Capacitor with Conductive Polymer; Manufacturer Part Number: 10TPB47M; Voltage: 10V; Tolerance: ±20%; Part Number: CTE3528-12_47UF_10V_20%_PANASONIC_TPB; Component Kind: Standard; Component Type: Standard; Pin Count: 2; Value: 47uF; Status: None; Manufacturer: PANASONIC; Case: B; Mounted: Yes; Socket: No; SMD: Yes; Sense: No; ComponentHeight: 2.1mm; HelpURL: \\cern.ch\dfs\Applications\Altium\Datasheets\CTE_PANASONIC_TPB.pdf; Author: CERN DEM JLC; CreateDate: 01/09/2014; LatestRevisionDate: 01/09/2014
C150 = CTE3528-21_100UF_6.3V_10%: Polarised capacitor; Part Description: Solid Tantalum Chip Capacitor; Manufacturer: GENERIC; Manufacturer1 Part Number: TAJB107K006R; Voltage: 6.3V; Tolerance: ±10%; Part Number: CTE3528-21_100UF_6.3V_10%; Component Kind: Standard; Component Type: Standard; Pin Count: 2; Value: 100uF; Status: Preferred; Manufacturer Part Number: CTE3528-21_100UF_6.3V_10%; Case: B; Mounted: Yes; Socket: No; SMD: Yes; Sense: No; HelpURL: \\cern.ch\dfs\Applications\Altium\Datasheets\CTE_AVX_TAJ.pdf; Author: CERN DEM JLC; CreateDate: 03.12.2007; LatestRevisionDate: 03.12.2007; Manufacturer1 Example: AVX; Manufacturer1 ComponentHeight: 2.1mm
C151 C153 C154 = CTE7343-31_220UF_6.3V_20%_LESR0009_KEMET_T520: Polarised capacitor; Part Description: Low ESR 0R009 Tantalum Chip Capacitor; Manufacturer: KEMET; Manufacturer Part Number: T520D227M006ATE009; Voltage: 6.3V; Tolerance: ±20%; Part Number: CTE7343-31_220UF_6.3V_20%_LESR0009_KEMET_T520; Component Kind: Standard; Component Type: Standard; Pin Count: 2; Value: 220uF; Status: Preferred; Case: D; Mounted: Yes; Socket: No; SMD: Yes; Sense: No; ComponentHeight: 3.1mm; HelpURL: \\cern.ch\dfs\Applications\Altium\Datasheets\CTE-LESR_KEMET_T520.pdf; Author: CERN DEM JLC; CreateDate: 25.10.2012; LatestRevisionDate: 25.10.2012
C157 C159 C160 = CC0603_10UF_16V_20%_X5R: Non-polarised capacitor; Part Description: SMD Multilayer Chip Ceramic Capacitor; Manufacturer: GENERIC; Manufacturer1 Part Number: GRM188R61C106MA73D; Voltage: 16V; TC: X5R; Tolerance: ±20%; Part Number: CC0603_10UF_16V_20%_X5R; Component Kind: Standard; Component Type: Standard; Pin Count: 2; Value: 10uF; Status: None; Manufacturer Part Number: CC0603_10UF_16V_20%_X5R; Case: 0603; Mounted: Yes; Socket: No; SMD: Yes; Sense: No; Manufacturer1 Example: MURATA; Manufacturer1 ComponentHeight: 0.8mm; HelpURL: \\cern.ch\dfs\Applications\Altium\Datasheets\CC0603_X5R_MURATA_GRM.pdf; Author: CERN DEM MR; CreateDate: 02.03.2016; LatestRevisionDate: 02.03.2016
C158 = CTE7343-31_330UF_6.3V_20%_LESR0025_KEMET_T520: Polarised capacitor; Manufacturer: KEMET; Part Description: Low ESR 0R025 Tantalum Chip Capacitor; Manufacturer Part Number: T520D337M006ATE025; Voltage: 6.3V; Tolerance: ±20%; Part Number: CTE7343-31_330UF_6.3V_20%_LESR0025_KEMET_T520; Component Kind: Standard; Component Type: Standard; Pin Count: 2; Value: 330uF; Status: None; Case: D; Mounted: Yes; Socket: No; SMD: Yes; Sense: No; ComponentHeight: 3.1mm; HelpURL: \\cern.ch\dfs\Applications\Altium\Datasheets\CTE-LESR_KEMET_T520.pdf; Author: CERN DEM JLC; CreateDate: 20/10/2010; LatestRevisionDate: 20/10/2010
C161-C163 = CC0402_100NF_25V_10%_X7R_YUDEN_TMK105B7104KVHF: Non-polarised capacitor; Part Description: SMD Multilayer Chip Ceramic Capacitor (High Dielectric Type) for Automotive / Industrial Applications; Manufacturer: TAIYO YUDEN; Voltage: 25V; TC: X7R; Tolerance: ±10%; Part Number: CC0402_100NF_25V_10%_X7R_YUDEN_TMK105B7104KVHF; Component Kind: Standard; Component Type: Standard; Pin Count: 2; Value: 100nF; Status: Not Recommended; Manufacturer Part Number: TMK105B7104KVHF; Case: 0402; Mounted: Yes; Socket: No; SMD: Yes; Sense: No; HelpURL: \\cern.ch\dfs\Applications\Altium\Datasheets\CC0402_TAIYO-YUDEN_TMK105B7104KVHF.pdf; Author: CERN DEM JLC; CreateDate: 10/05/2017; LatestRevisionDate: 10/05/2017; ComponentHeight: 0.55mm

## Sheet FPGA_SpW_Misc.SchDoc: SVPXFMC Carrier 3U
size 420 x 297 mm; CheckedBy: \; Author: G.Kasprowicz; CompanyName: ISE; DrawnBy: T.Przywozki; Organization: WUT ISE; Address1: Warsaw University of Technology; Address2: Nowowiejska 15/19 00-665 Warsaw; Revision: 1.0.; SheetNumber: 11; SheetTotal: 20; Project: SVPXFMC Carrier 3U; ModifiedBy: -; CheckedDate: -; Title2: FPGA SpaceWire; DivGrp: ISE; Designer: G. Kasprowicz
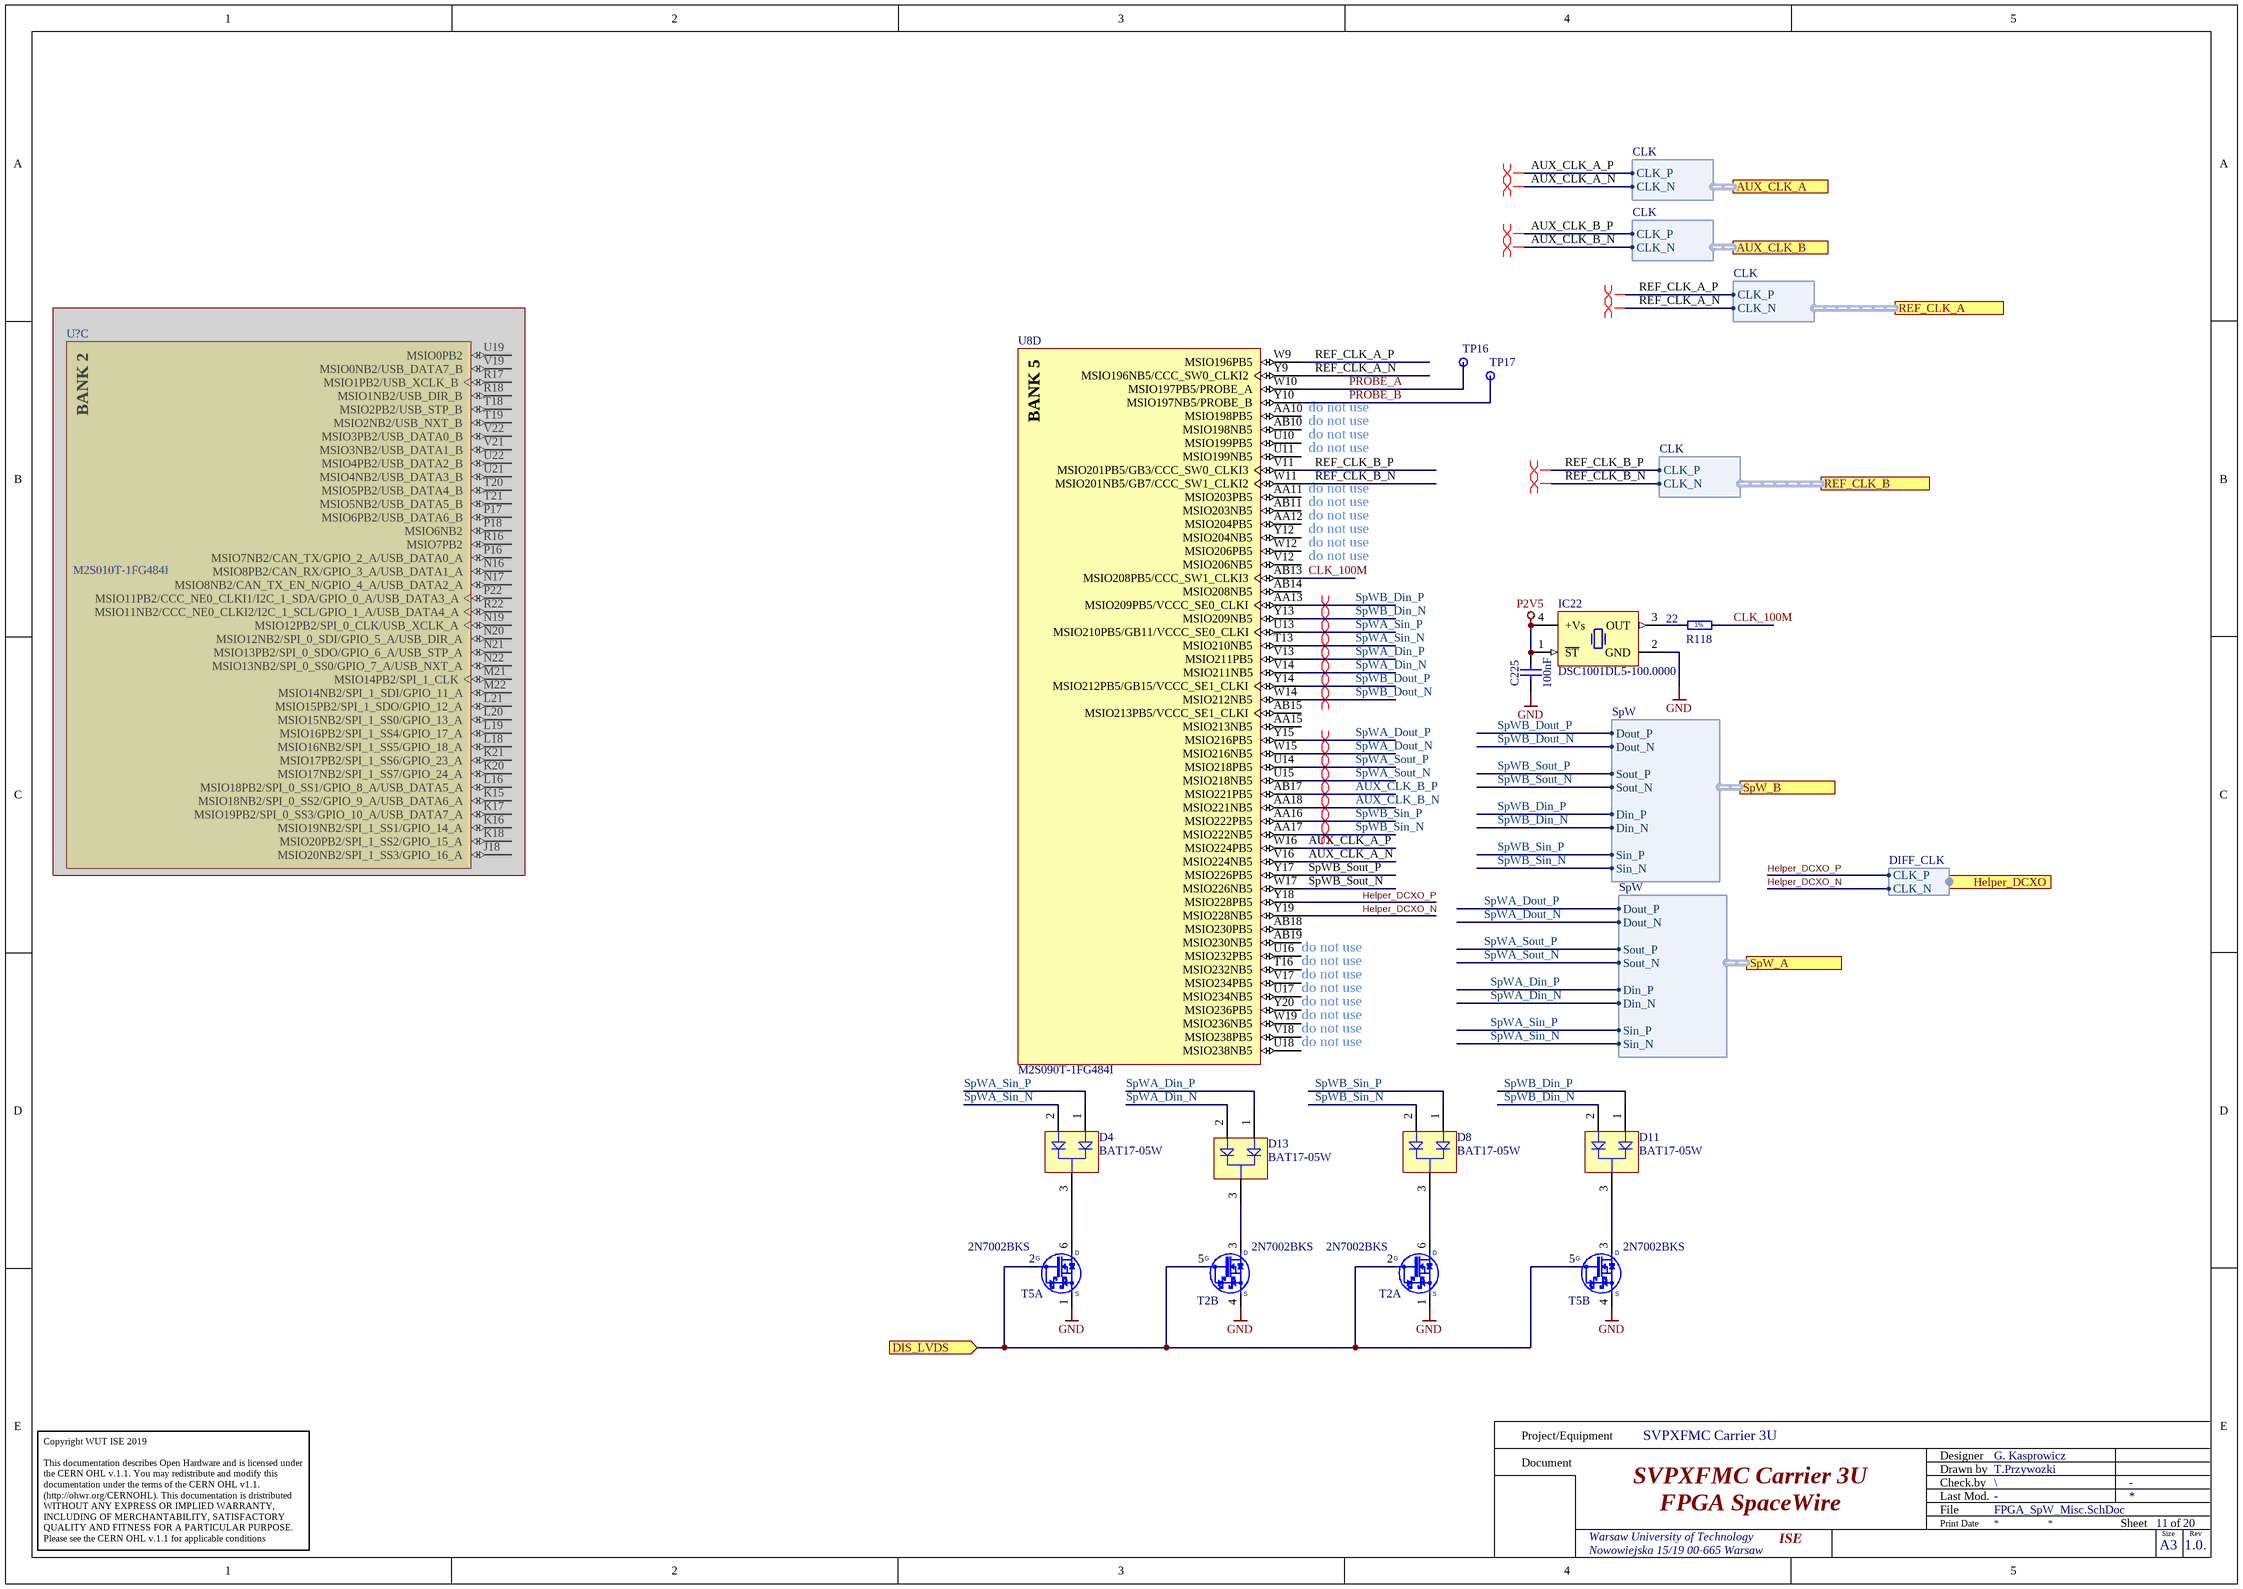
[diagram p12: FPGA_SpW_Misc.SchDoc]

### Parts
(Parts that share a designator on the sheet are numbered #1, #2 ... from top to bottom, then left to right.)
C225  100nF  [CAPC0603X33N]
D4  BAT17-05W  [INF-SOT323_N]
D8  BAT17-05W  [INF-SOT323_N]
D11  BAT17-05W  [INF-SOT323_N]
D13  BAT17-05W  [INF-SOT323_N]
IC22  DSC1001DL5-100.0000  [OSC_MICREL_2520]
R118  22  [RESC1005X40N]
T2  2N7002BKS  [SOT65P210X110-6N]  (parts A,B of 2)
T5  2N7002BKS  [SOT65P210X110-6N]  (parts A,B of 2)
TP16  Test Point  [TPS127]  (value not drawn)
TP17  Test Point  [TPS127]  (value not drawn)
U8  M2S090T-1FG484I  [MCSM-FG-484_V]  (part D of 15)
U?#14  M2S010T-1FG484I  [MCSM-FG-484_V]  (part C of 16)  (masked out: inside a compile mask, not in the netlist)

### Ports
AUX_CLK_A (harness CLK), AUX_CLK_B (harness CLK), DIS_LVDS (in), Helper_DCXO (harness DIFF_CLK), REF_CLK_A (harness CLK), REF_CLK_B (harness CLK), SpW_A (harness SpW), SpW_B (harness SpW)

### Harnesses
SpW: Sout_P, Sout_N, Dout_P, Dout_N, Sin_P, Sin_N, Din_P, Din_N
CLK: CLK_P, CLK_N
DIFF_CLK: CLK_N, CLK_P

### Nets
GND: C225.1 IC22.2(GND) T2.1(S) T2.4(S) T5.1(S) T5.4(S)
P2V5: C225.2 IC22.1(~{ST}) IC22.4(+Vs)
AUX_CLK_A_N: U8.V16(MSIO224NB5) ; port AUX_CLK_A.CLK_N
AUX_CLK_A_P: U8.W16(MSIO224PB5) ; port AUX_CLK_A.CLK_P
AUX_CLK_B_N: U8.AA18(MSIO221NB5) ; port AUX_CLK_B.CLK_N
AUX_CLK_B_P: U8.AB17(MSIO221PB5) ; port AUX_CLK_B.CLK_P
CLK_100M: R118.2 U8.AB13(MSIO208PB5/CCC_SW1_CLKI3)  [project net CLK_100M_11]
DIS_LVDS: T2.2(G) T2.5(G) T5.2(G) T5.5(G) ; port DIS_LVDS
Helper_DCXO_N: U8.Y19(MSIO228NB5) ; port Helper_DCXO.CLK_N
Helper_DCXO_P: U8.Y18(MSIO228PB5) ; port Helper_DCXO.CLK_P
PROBE_A: TP16.1 U8.W10(MSIO197PB5/PROBE_A)  [project net PROBE_A_11]
PROBE_B: TP17.1 U8.Y10(MSIO197NB5/PROBE_B)  [project net PROBE_B_11]
REF_CLK_A_N: U8.Y9(MSIO196NB5/CCC_SW0_CLKI2) ; port REF_CLK_A.CLK_N
REF_CLK_A_P: U8.W9(MSIO196PB5) ; port REF_CLK_A.CLK_P
REF_CLK_B_N: U8.W11(MSIO201NB5/GB7/CCC_SW1_CLKI2) ; port REF_CLK_B.CLK_N  [project net REF_CLK2_N]
REF_CLK_B_P: U8.V11(MSIO201PB5/GB3/CCC_SW0_CLKI3) ; port REF_CLK_B.CLK_P  [project net REF_CLK2_P]
SpWA_Din_N: D13.2(A2) U8.V14(MSIO211NB5) ; port SpW_A.Din_N  [project net CPtp01-DC_N]
SpWA_Din_P: D13.1(A1) U8.V13(MSIO211PB5) ; port SpW_A.Din_P  [project net CPtp01-DC_P]
SpWA_Dout_N: U8.W15(MSIO216NB5) ; port SpW_A.Dout_N  [project net CPtp01-DD_N]
SpWA_Dout_P: U8.Y15(MSIO216PB5) ; port SpW_A.Dout_P  [project net CPtp01-DD_P]
SpWA_Sin_N: D4.2(A2) U8.T13(MSIO210NB5) ; port SpW_A.Sin_N  [project net CPtp01-DA_N]
SpWA_Sin_P: D4.1(A1) U8.U13(MSIO210PB5/GB11/VCCC_SE0_CLKI) ; port SpW_A.Sin_P  [project net CPtp01-DA_P]
SpWA_Sout_N: U8.U15(MSIO218NB5) ; port SpW_A.Sout_N  [project net CPtp01-DB_N]
SpWA_Sout_P: U8.U14(MSIO218PB5) ; port SpW_A.Sout_P  [project net CPtp01-DB_P]
SpWB_Din_N: D11.2(A2) U8.Y13(MSIO209NB5) ; port SpW_B.Din_N  [project net CPtp02-DC_N]
SpWB_Din_P: D11.1(A1) U8.AA13(MSIO209PB5/VCCC_SE0_CLKI) ; port SpW_B.Din_P  [project net CPtp02-DC_P]
SpWB_Dout_N: U8.W14(MSIO212NB5) ; port SpW_B.Dout_N  [project net CPtp02-DD_N]
SpWB_Dout_P: U8.Y14(MSIO212PB5/GB15/VCCC_SE1_CLKI) ; port SpW_B.Dout_P  [project net CPtp02-DD_P]
SpWB_Sin_N: D8.2(A2) U8.AA17(MSIO222NB5) ; port SpW_B.Sin_N  [project net CPtp02-DA_N]
SpWB_Sin_P: D8.1(A1) U8.AA16(MSIO222PB5) ; port SpW_B.Sin_P  [project net CPtp02-DA_P]
SpWB_Sout_N: U8.W17(MSIO226NB5) ; port SpW_B.Sout_N  [project net CPtp02-DB_N]
SpWB_Sout_P: U8.Y17(MSIO226PB5) ; port SpW_B.Sout_P  [project net CPtp02-DB_P]
NetD4_3: D4.3(K) T5.6(D)
NetD8_3: D8.3(K) T2.6(D)
NetD11_3: D11.3(K) T5.3(D)
NetD13_3: D13.3(K) T2.3(D)
NetIC22_3: IC22.3(OUT) R118.1

Not connected (* = marked no-connect by the designer): U8 AA10(MSIO198PB5) AA11(MSIO203PB5) AA12(MSIO204PB5) AA15(MSIO213NB5) AB10(MSIO198NB5) AB11(MSIO203NB5) AB14(MSIO208NB5) AB15(MSIO213PB5/VCCC_SE1_CLKI) AB18(MSIO230PB5) AB19(MSIO230NB5) T16(MSIO232NB5) U10(MSIO199PB5) U11(MSIO199NB5) U16(MSIO232PB5) U17(MSIO234NB5) U18(MSIO238NB5) V12(MSIO206NB5) V17(MSIO234PB5) V18(MSIO238PB5) W12(MSIO206PB5) W19(MSIO236NB5) Y12(MSIO204NB5) Y20(MSIO236PB5)

### Layout directives
differential pair: AUX_CLK_A_N, AUX_CLK_A_P, AUX_CLK_B_N, AUX_CLK_B_P, CPtp01-DA_N, CPtp01-DA_P, CPtp01-DB_N, CPtp01-DB_P, CPtp01-DC_N, CPtp01-DC_P, CPtp01-DD_N, CPtp01-DD_P, CPtp02-DA_N, CPtp02-DA_P, CPtp02-DC_N, CPtp02-DC_P, CPtp02-DD_N, CPtp02-DD_P, REF_CLK2_N, REF_CLK2_P, REF_CLK_A_N, REF_CLK_A_P

### Notes on the sheet
- (near U8) do not use
- Project/Equipment
- Document
- Designer
- Drawn by
- Check.by
- File
- Last Mod.
- Print Date
- Sheet
- Size
- A3
- of
- Rev
- Copyright WUT ISE 2019
  This documentation describes Open Hardware and is licensed under the CERN OHL v.1.1. You may redistribute and modify this documentation under the terms of the CERN OHL v1.1.
  (http://ohwr.org/CERNOHL). This documentation is dristributed WITHOUT ANY EXPRESS OR IMPLIED WARRANTY, INCLUDING OF MERCHANTABILITY, SATISFACTORY QUALITY AND FITNESS FOR A PARTICULAR PURPOSE. Please see the CERN OHL v.1.1 for applicable conditions
- (in symbol CMP-0959-00045-1, part D) BANK 5
- (in symbol CMP-0959-00069-1, part C) BANK 2
- (in symbol R0402_22R_1%_0.0625W_100PPM) 1%

### Library data of the parts
C225 = CC0201_100NF_6.3V_10%_X5R: as C2 on sheet Decoupling_caps; Part Number: CC0201_100NF_6.3V_10%_X5R; Component Kind: Standard; Component Type: Standard; Pin Count: 2; Value: 100nF; Status: Not Recommended; Manufacturer Part Number: CC0201_100NF_6.3V_10%_X5R; Case: 0201; Mounted: Yes; Socket: No; SMD: Yes; Sense: No; Manufacturer1 Example: AVX; Manufacturer1 ComponentHeight: 0.33mm; HelpURL: \\cern.ch\dfs\Applications\Altium\Datasheets\CC0201_X5R_AVX.pdf; Author: CERN DEM JLC; CreateDate: 03/12/2007; LatestRevisionDate: 03/12/2007
D4 D8 D11 D13 = CMP-1154-00018-1: Dual Silicon Schottky Diode, 130 mA IF Max, SOT323, Green; Manufacturer: Infineon; VF (typ): 0.34 V; CT (typ): 0.55 pF; Green: yes; Group: RF Mixer; IF (max): 130 mA; VR (max): 4 V; ComponentLink1URL: http://www.infineon.com/; Mounting Technology: Surface Mount; Halogen-free: yes; DatasheetVersion: Jun-2011; ComponentLink3Description: Package Specification; ComponentLink2URL: http://www.infineon.com/dgdl/bat17series.pdf?folderId=db3a304314dca3890114ff6812070b44&fileId=db3a304314dca389011517d785d60d4e&location=en.Products.RF.RF_Mixer___Detector_Schottky_Diodes.DATASHEET.bat17series.pdf; PartNumber: BAT17-05W; ComponentLink3URL: http://www.infineon.com/dgdl/SOT323-Package_Overview.pdf?folderId=db3a30431936bc4b0119533e1dcb3c92&fileId=db3a30431936bc4b011953495f283cb1; Configuration: Dual; PackageDescription: 3-Pin Small Outline Transistor Package, 1.25 x 2 mm Body, 0.65 mm Pitch; ComponentLink1Description: Manufacturer URL; ComponentLink2Description: Datasheet; PackageReference: SOT323
IC22 = OSC_DSC1001DL5-100.0000: MEMS 100MHz oscillator; Manufacturer: Micrel; Part Description: MEMS Oscillator 100MHz; Bonding: No; PressFit: No; Case: *; Component Kind: Standard; Component Type: Standard; ComponentHeigth: *; CreateDate: 2018-01-01; Device: DSC1001DL5-100.0000; Footprint: *; HelpURL: *; LatestRevisionDate: 2018-01-01; Manufacturer Part Number: DSC1001DL5-100.0000; Mounted: Yes; PackageDescription: MICREL SMD Oscillator, QFN, 4 pins, 2.5mm x 2.0mm; Part Number: DSC1001DL5-100.0000; Pin Count: 4; Sense: No; SMD: Yes; Socket: No; Value: *
R118 = R0402_22R_1%_0.0625W_100PPM: Resistor - 1%; Part Description: General Purpose Thick Film Chip Resistor; Manufacturer: GENERIC; Manufacturer1 Part Number: 232270672209L; TC: ±100ppm/°C; PressFit: No; Part Number: R0402_22R_1%_0.0625W_100PPM; Component Kind: Standard; Component Type: Standard; Pin Count: 2; Value: 22; Status: Not Recommended; Power: 0.0625W; Tolerance: ±1%; Manufacturer Part Number: R0402_22R_1%_0.0625W_100PPM; Case: 0402; Mounted: Yes; Sense: No; Socket: No; SMD: Yes; Manufacturer1 Example: YAGEO PHYCOMP; Manufacturer1 ComponentHeight: 0.4mm; HelpURL: \\cern.ch\dfs\Applications\Altium\Datasheets\R0402_Phycomp_RC0402.pdf; Author: CERN DEM JLC; CreateDate: 03/12/2007; LatestRevisionDate: 17/10/2012
T2 T5 = 2N7002BKS: 60V, 300mA Dual N-Channel Trench MOSFET; Manufacturer: NXP SEMICONDUCTORS; Manufacturer Part Number: 2N7002BKS6; PressFit: No; Bonding: No; Part Number: 2N7002BKS; Component Kind: Standard; Component Type: Standard; Device: 2N7002BKS; PackageDescription: SOT363, SC70-6, SOT, 0.65mm Pitch, 6 pin, 1.25mm W X 2.00mm L X 1.10mm H, IPC Medium Density; Part Description: 60 V, 300 mA Dual N-Channel Trench MOSFET; Pin Count: 4; Case: SOT363; Mounted: Yes; Socket: No; SMD: Yes; Sense: No; ComponentHeight: 1.1mm; HelpURL: \\cern.ch\dfs\Applications\Altium\Datasheets\2N7002BKS.pdf; Author: CERN DEM JLC; CreateDate: 2012-11-27; LatestRevisionDate: 2012-11-27
TP16 TP17 = SMD_PAD_1.27X1.27MM: Part Description: 1.27mm x 1.27mm PCB Copper Area (SMD Test Point); Mounted: No; Part Number: SMD_PAD_1.27X1.27MM; Component Kind: Standard (No BOM); Component Type: Standard (No BOM); Pin Count: 1; Family: Test Point; Socket: No; SMD: Yes; Sense: No; Status: None; ComponentHeight: 0mm; HelpURL: Undefined; Author: CERN DEM JLC; CreateDate: 12.01.2008; LatestRevisionDate: 12.01.2008; PackageDescription: 1.27mm x 1.27mm PCB Copper Area (SMD Test Point)
U8 = CMP-0959-00045-1: SmartFusion2 SoC FPGA, ARM Cortex-M3, 90 K LUTs, 267 User I/O, Transceiver Available, Design Security, Speed Grade 1, -40 to 100 degC, 484-Ball BGA; Manufacturer: Microsemi; Total User I/O: 267; PLLs and CCCs: 6; LSRAM 18K Blocks: 109; eNVM (K Bytes): 512; DDR Controllers (Count x Width): 1x18; Math Blocks (18x18): 84; Maximum Logic Elements: 86,316; eSRAM (K Bytes): 64; MSIOD (2.5V): 40; SERDES Lanes: 4; MSIO (3.3V): 157; Total RAM (K bits): 2074; DDRIO (2.5V): 70; uSRAM1K Blocks: 112; eSRAM (K Bytes) Non SECDED: 80; ComponentLink3URL: http://www.microsemi.com/document-portal/doc_download/131095-package-mechanical-drawings; DatasheetVersion: Rev. 5; ComponentLink3Description: Package Specification; ComponentLink1Description: Manufacturer URL; PackageReference: FG-484; RoHS: FALSE; ComponentLink1URL: http://www.microsemi.com/; Code_JEDEC: MS-034; Mounting Technology: Surface Mount; PackageDescription: 484-Ball Fine Pitch Plastic Ball Grid Array (FBGA), Body 23 x 23 mm, Pitch 1 mm; PackageVersion: Rev. 48, 11/2013; ComponentLink2URL: http://www.microsemi.com/document-portal/doc_download/130717-smartfusion2-datasheet; PartNumber: M2S090T-1FG484I; ComponentLink2Description: Datasheet; PartId: 1
U?#14 = CMP-0959-00069-1: SmartFusion2 SoC FPGA, ARM Cortex-M3, 10 K LUTs, 233 User I/O, Transceiver Available, Design Security, Speed Grade 1, -40 to 100 degC, 484-Ball BGA; Manufacturer: Microsemi; MSIO (3.3V): 123; DDRIO (2.5V): 70; eSRAM (K Bytes): 64; uSRAM1K Blocks: 22; SERDES Lanes: 4; DDR Controllers (Count x Width): 1x18; MSIOD (2.5V): 40; Maximum Logic Elements: 12,084; eNVM (K Bytes): 256; PLLs and CCCs: 2; LSRAM 18K Blocks: 21; eSRAM (K Bytes) Non SECDED: 80; Total RAM (K bits): 400; Total User I/O: 233; PackageVersion: Rev. 48, 11/2013; ComponentLink3URL: http://www.microsemi.com/document-portal/doc_download/131095-package-mechanical-drawings; ComponentLink1Description: Manufacturer URL; DatasheetVersion: Rev. 5; RoHS: FALSE; ComponentLink2Description: Datasheet; Code_JEDEC: MS-034; ComponentLink3Description: Package Specification; ComponentLink2URL: http://www.microsemi.com/document-portal/doc_download/130717-smartfusion2-datasheet; PartNumber: M2S010T-1FG484I; ComponentLink1URL: http://www.microsemi.com/; Math Blocks (18x18): 22; Mounting Technology: Surface Mount; PackageDescription: 484-Ball Fine Pitch Plastic Ball Grid Array (FBGA), Body 23 x 23 mm, Pitch 1 mm; PackageReference: FG-484

## Sheet SLT3-PAY-1Q2T_P0.SchDoc: SVPXFMC Carrier 3U
size A4; CheckedBy: \; Author: G.Kasprowicz; CompanyName: ISE; DrawnBy: T.Przywozki; Organization: WUT ISE; Address1: Warsaw University of Technology; Address2: Nowowiejska 15/19 00-665 Warsaw; Revision: 1.0.; SheetNumber: 14; SheetTotal: 20; Project: SVPXFMC Carrier 3U; ModifiedBy: -; CheckedDate: -; Title2: SpaceVPX P0, SLT3-PAY-1Q2T; DivGrp: ISE; Designer: G. Kasprowicz
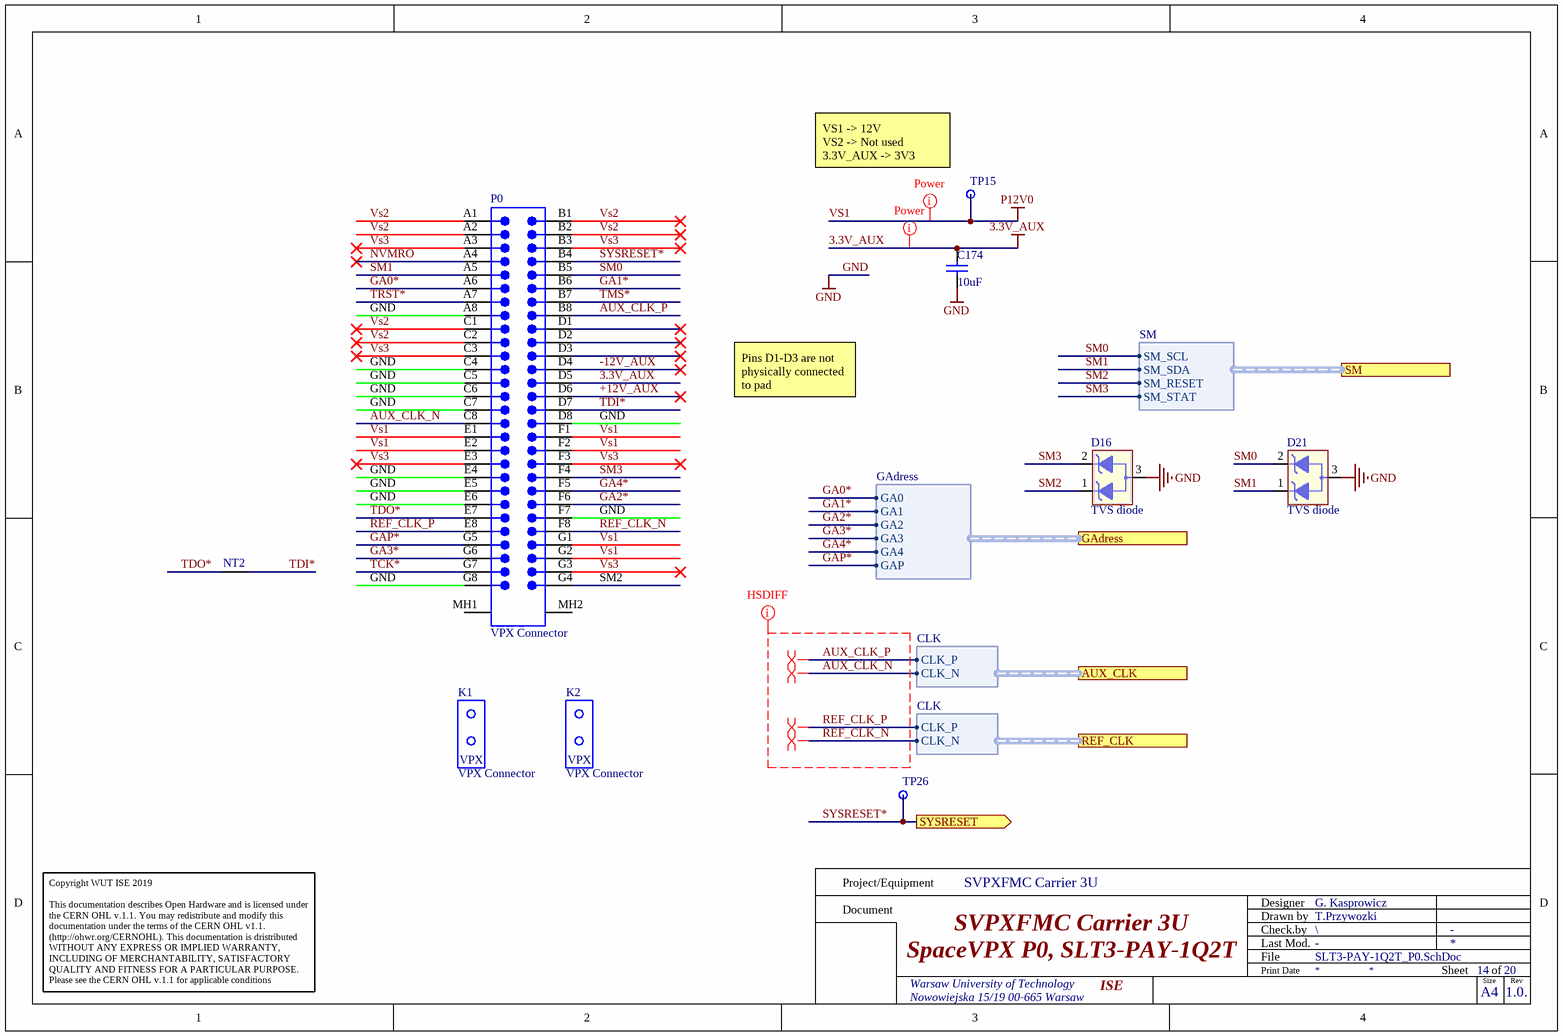
[diagram p13: SLT3-PAY-1Q2T_P0.SchDoc]

### Parts
C174  10uF  [CAPC2012X135N]
D16  TVS diode  [SOT-723_(ESD7C3.3DT5G)]
D21  TVS diode  [SOT-723_(ESD7C3.3DT5G)]
K1  VPX Connector  [BTB5-5-2H2F]
K2  VPX Connector  [BTB5-5-2H2F]
NT2  Net Tie  [Net Tie]  (value not drawn)  (net tie, no BOM)
P0  VPX Connector  [BTB1-8-2H56M]
TP15  Test Point  [TPS127]  (value not drawn)
TP26  Test Point  [TPS127]  (value not drawn)

### Ports
AUX_CLK (harness CLK), GAdress (harness GAdress), REF_CLK (harness CLK), SM (harness SM), SYSRESET (out)

### Harnesses
SM: SM_SCL, SM_SDA, SM_RESET, SM_STAT
GAdress: GA0, GA1, GA2, GA3, GA4, GAP
CLK: CLK_P, CLK_N

### Nets
3.3V_AUX: C174.2 P0.D5
GND: C174.1 D16.3 D21.3 P0.A8 P0.C4 P0.C5 P0.C6 P0.C7 P0.D8 P0.E4 P0.E5 P0.E6 P0.F7 P0.G8
VS1: P0.E1 P0.E2 P0.F1 P0.F2 P0.G1 P0.G2 TP15.1  [also labelled P12V0]
+12V_AUX: P0.D6  [project net +12V_AUX_14]
-12V_AUX: P0.D4  [project net -12V_AUX_14]
AUX_CLK_N: P0.C8 ; port AUX_CLK.CLK_N  [project net AUX_CLK_A_N]
AUX_CLK_P: P0.B8 ; port AUX_CLK.CLK_P  [project net AUX_CLK_A_P]
GA0*: P0.A6 ; port GAdress.GA0  [project net GA0]
GA1*: P0.B6 ; port GAdress.GA1  [project net GA1]
GA2*: P0.F6 ; port GAdress.GA2  [project net GA2]
GA3*: P0.G6 ; port GAdress.GA3  [project net GA3]
GA4*: P0.F5 ; port GAdress.GA4  [project net GA4]
GAP*: P0.G5 ; port GAdress.GAP  [project net GAP]
NVMRO: P0.A4  [project net NVMRO_14]
REF_CLK_N: P0.F8 ; port REF_CLK.CLK_N  [project net REF_CLK_A_N]
REF_CLK_P: P0.E8 ; port REF_CLK.CLK_P  [project net REF_CLK_A_P]
SM0: D21.2 P0.B5 ; port SM.SM_SCL
SM1: D21.1 P0.A5 ; port SM.SM_SDA
SM2: D16.1 P0.G4 ; port SM.SM_RESET
SM3: D16.2 P0.F4 ; port SM.SM_STAT
SYSRESET*: P0.B4 TP26.1 ; port SYSRESET
TCK*: P0.G7  [project net TCK*_14]
TDI*: NT2.2 P0.D7  [project net TDI*_14]
TDO*: NT2.1 P0.E7  [project net TDO*_14]
TMS*: P0.B7  [project net TMS*_14]
TRST*: P0.A7  [project net TRST*_14]
Vs2: P0.A1 P0.A2 P0.B1 P0.B2 P0.C1 P0.C2  [project net Vs2_14]
Vs3: P0.A3 P0.B3 P0.C3 P0.E3 P0.F3 P0.G3  [project net Vs3_14]

Not connected (* = marked no-connect by the designer): P0 D1* D2* D3* MH1 MH2

### Layout directives
differential pair: AUX_CLK_A_N, AUX_CLK_A_P, REF_CLK_A_N, REF_CLK_A_P
net class HSDIFF: AUX_CLK_N, AUX_CLK_P, REF_CLK_N, REF_CLK_P
net class Power: 3.3V_AUX, VS1

### Notes on the sheet
- (near TP15) VS1 -> 12V
  VS2 -> Not used
  3.3V_AUX -> 3V3
- Pins D1-D3 are not physically connected to pad
- Project/Equipment
- Document
- Designer
- Drawn by
- Check.by
- Copyright WUT ISE 2019
  This documentation describes Open Hardware and is licensed under the CERN OHL v.1.1. You may redistribute and modify this documentation under the terms of the CERN OHL v1.1.
  (http://ohwr.org/CERNOHL). This documentation is dristributed WITHOUT ANY EXPRESS OR IMPLIED WARRANTY, INCLUDING OF MERCHANTABILITY, SATISFACTORY QUALITY AND FITNESS FOR A PARTICULAR PURPOSE. Please see the CERN OHL v.1.1 for applicable conditions
- File
- Last Mod.
- Print Date
- Sheet
- Size
- A4
- of
- Rev
- (in symbol 2000713-6) VPX

### Library data of the parts
C174 = CC0805_10UF_16V_10%_X5R: as C110 on sheet Decoupling_caps; Part Number: CC0805_10UF_16V_10%_X5R; Component Kind: Standard; Component Type: Standard; Pin Count: 2; Value: 10uF; Status: Preferred; Manufacturer Part Number: CC0805_10UF_16V_10%_X5R; Case: 0805; Mounted: Yes; Socket: No; SMD: Yes; Sense: No; Manufacturer1 Example: KEMET; Manufacturer1 ComponentHeight: 1.4mm; HelpURL: \\cern.ch\dfs\Applications\Altium\Datasheets\CC1206_X5R_KEMET.pdf; Author: CERN DEM JLC; CreateDate: 03/12/2007; LatestRevisionDate: 03/12/2007
D16 D21 = ESD7C3.3DT5G: Dual TVS diode, Vrwm=3.3V; Manufacturer: ON Semiconductor; Bonding: No; ComponentHeigth: 0.5mm; PressFit: No; Value: 3.3V; Case: SOT-723; Component Kind: Standard; Component Type: Standard; CreateDate: 2018-06-18; Device: TVS diode; HelpURL: https://www.onsemi.com/pub/Collateral/ESD7C3.3D-D.PDF; LatestRevisionDate: 2018-06-18; Manufacturer Part Number: ESD7C3.3DT5G; Mounted: Yes; PackageDescription: SOT-723; Part Description: TVS diode; Part Number: ESD7C3.3DT5G; Pin Count: 3; Sense: No; SMD: Yes; Socket: No
K1 K2 = 2000713-6: VPX VITA 46 Alignment key Ruggedized, Right Angle, 1Key, Key orientation 0; Manufacturer: TE; Bonding: No; ComponentHeigth: 9.7mm; PressFit: No; Case: *; Component Kind: Standard; Component Type: Standard; CreateDate: 2018-01-01; Device: 2000713-6; Footprint: 2000713-6; HelpURL: *; LatestRevisionDate: 2018-01-01; Manufacturer Part Number: 2000713-6; Mounted: Yes; PackageDescription: *; Part Description: VPX VITA 46 Alignment key Ruggedized, Right Angle, 1Key, Key orientation 0; Part Number: 2000713-6; Pin Count: *; Sense: No; SMD: Yes; Socket: No; Family: VPX Connector
NT2 = Net Tie: Part Description: Net Tie (2 Nets); Mounted: No; Part Number: Net Tie; Component Type: Net Tie; Pin Count: 2; Family: Net Tie; Socket: No; SMD: No; Sense: No; Status: None; ComponentHeight: 0mm; HelpURL: Undefined; Author: CERN DEM JLC; CreateDate: 22.03.2011; LatestRevisionDate: 22.03.2011; PackageDescription: 2 Plated Through Hole For Coaxial Cable Link: Hole Dia.=1.4mm Pad Dia.=2.5mm
P0 = 2102772-1: Ruggedized Board-to-Board Connector, Right Angle, 7-Row, Pitch 1.8mm, 56-Position; Manufacturer: TE; Bonding: No; ComponentHeigth: 14.7mm; PressFit: No; Case: *; Component Kind: Standard; Component Type: Standard; CreateDate: 2018-01-01; Device: 2102772-1; Footprint: 2102772-1; HelpURL: *; LatestRevisionDate: 2018-01-01; Manufacturer Part Number: 2102772-1; Mounted: Yes; PackageDescription: *; Part Description: Ruggedized Board-to-Board Connector, Right Angle, 7-Row, Pitch 1.8mm, 56-Position; Part Number: 2102772-1; Pin Count: *; Sense: No; SMD: Yes; Socket: No; Family: VPX Connector
TP15 TP26 = SMD_PAD_1.27X1.27MM: as TP16 on sheet FPGA_SpW_Misc; Part Number: SMD_PAD_1.27X1.27MM; Component Kind: Standard (No BOM); Component Type: Standard (No BOM); Pin Count: 1; Family: Test Point; Socket: No; SMD: Yes; Sense: No; Status: None; ComponentHeight: 0mm; HelpURL: Undefined; Author: CERN DEM JLC; CreateDate: 12.01.2008; LatestRevisionDate: 12.01.2008; PackageDescription: 1.27mm x 1.27mm PCB Copper Area (SMD Test Point)